# EAGLE schematic module_alu1_ctrl (EAGLE 6.5.0)

## Sheet 1 of 14
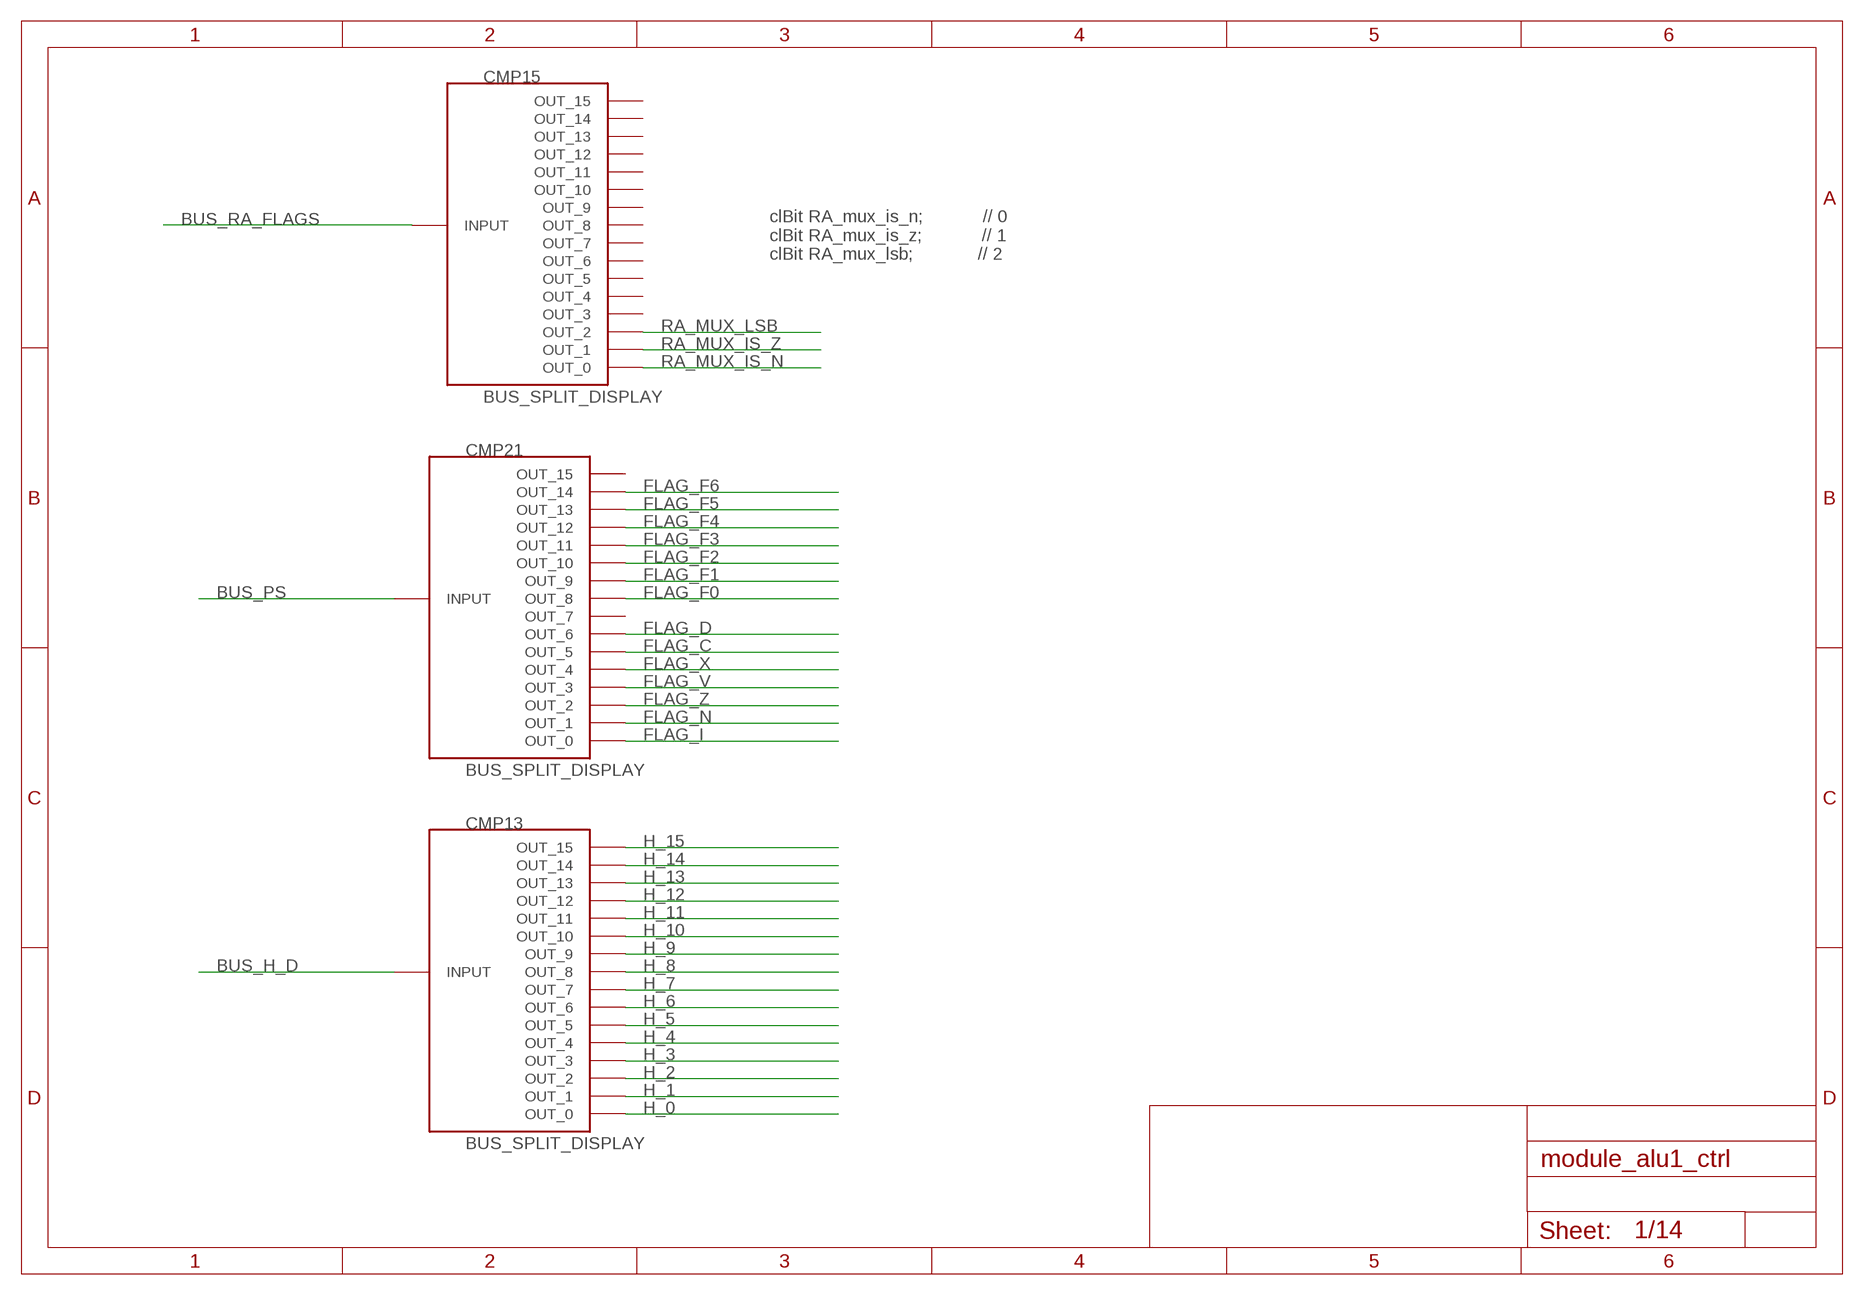
[diagram p0: schematic, sheet 1]

### Parts
CMP13  BUS_SPLIT_DISPLAY  [BUS_SPLIT_DISPLAY]
CMP15  BUS_SPLIT_DISPLAY  [BUS_SPLIT_DISPLAY]
CMP21  BUS_SPLIT_DISPLAY  [BUS_SPLIT_DISPLAY]

### Nets
BUS_H_D: CMP13.INPUT
BUS_PS: CMP21.INPUT
BUS_RA_FLAGS: CMP15.INPUT
FLAG_C: CMP21.P$6(OUT_5)
FLAG_D: CMP21.P$7(OUT_6)
FLAG_F0: CMP21.P$9(OUT_8)
FLAG_F1: CMP21.P$10(OUT_9)
FLAG_F2: CMP21.P$11(OUT_10)
FLAG_F3: CMP21.P$12(OUT_11) ; also sheet 6
FLAG_F4: CMP21.P$13(OUT_12)
FLAG_F5: CMP21.P$14(OUT_13)
FLAG_F6: CMP21.P$15(OUT_14) ; also sheet 11
FLAG_I: CMP21.P$1(OUT_0)
FLAG_N: CMP21.P$2(OUT_1)
FLAG_V: CMP21.P$4(OUT_3)
FLAG_X: CMP21.P$5(OUT_4) ; also sheet 7,9
FLAG_Z: CMP21.P$3(OUT_2)
H_0: CMP13.P$1(OUT_0) ; also sheet 14
H_1: CMP13.P$2(OUT_1) ; also sheet 4,14
H_2: CMP13.P$3(OUT_2) ; also sheet 4,14
H_3: CMP13.P$4(OUT_3) ; also sheet 4,14
H_4: CMP13.P$5(OUT_4) ; also sheet 7,8,14
H_5: CMP13.P$6(OUT_5)
H_6: CMP13.P$7(OUT_6) ; also sheet 5
H_7: CMP13.P$8(OUT_7) ; also sheet 5
H_8: CMP13.P$9(OUT_8)
H_9: CMP13.P$10(OUT_9)
H_10: CMP13.P$11(OUT_10)
H_11: CMP13.P$12(OUT_11)
H_12: CMP13.P$13(OUT_12)
H_13: CMP13.P$14(OUT_13)
H_14: CMP13.P$15(OUT_14)
H_15: CMP13.P$16(OUT_15)
RA_MUX_IS_N: CMP15.P$1(OUT_0) ; also sheet 7,9
RA_MUX_IS_Z: CMP15.P$2(OUT_1)
RA_MUX_LSB: CMP15.P$3(OUT_2) ; also sheet 9,13
Unconnected: CMP15.P$4(OUT_3) CMP15.P$5(OUT_4) CMP15.P$6(OUT_5) CMP15.P$7(OUT_6) CMP15.P$8(OUT_7) CMP15.P$9(OUT_8) CMP15.P$10(OUT_9) CMP15.P$11(OUT_10) CMP15.P$12(OUT_11) CMP15.P$13(OUT_12) CMP15.P$14(OUT_13) CMP15.P$15(OUT_14) CMP15.P$16(OUT_15) CMP21.P$8(OUT_7) CMP21.P$16(OUT_15)

### Notes on the sheet
- clBit RA_mux_is_n;            // 0 
      clBit RA_mux_is_z;            // 1
      clBit RA_mux_lsb;             // 2

## Sheet 2 of 14
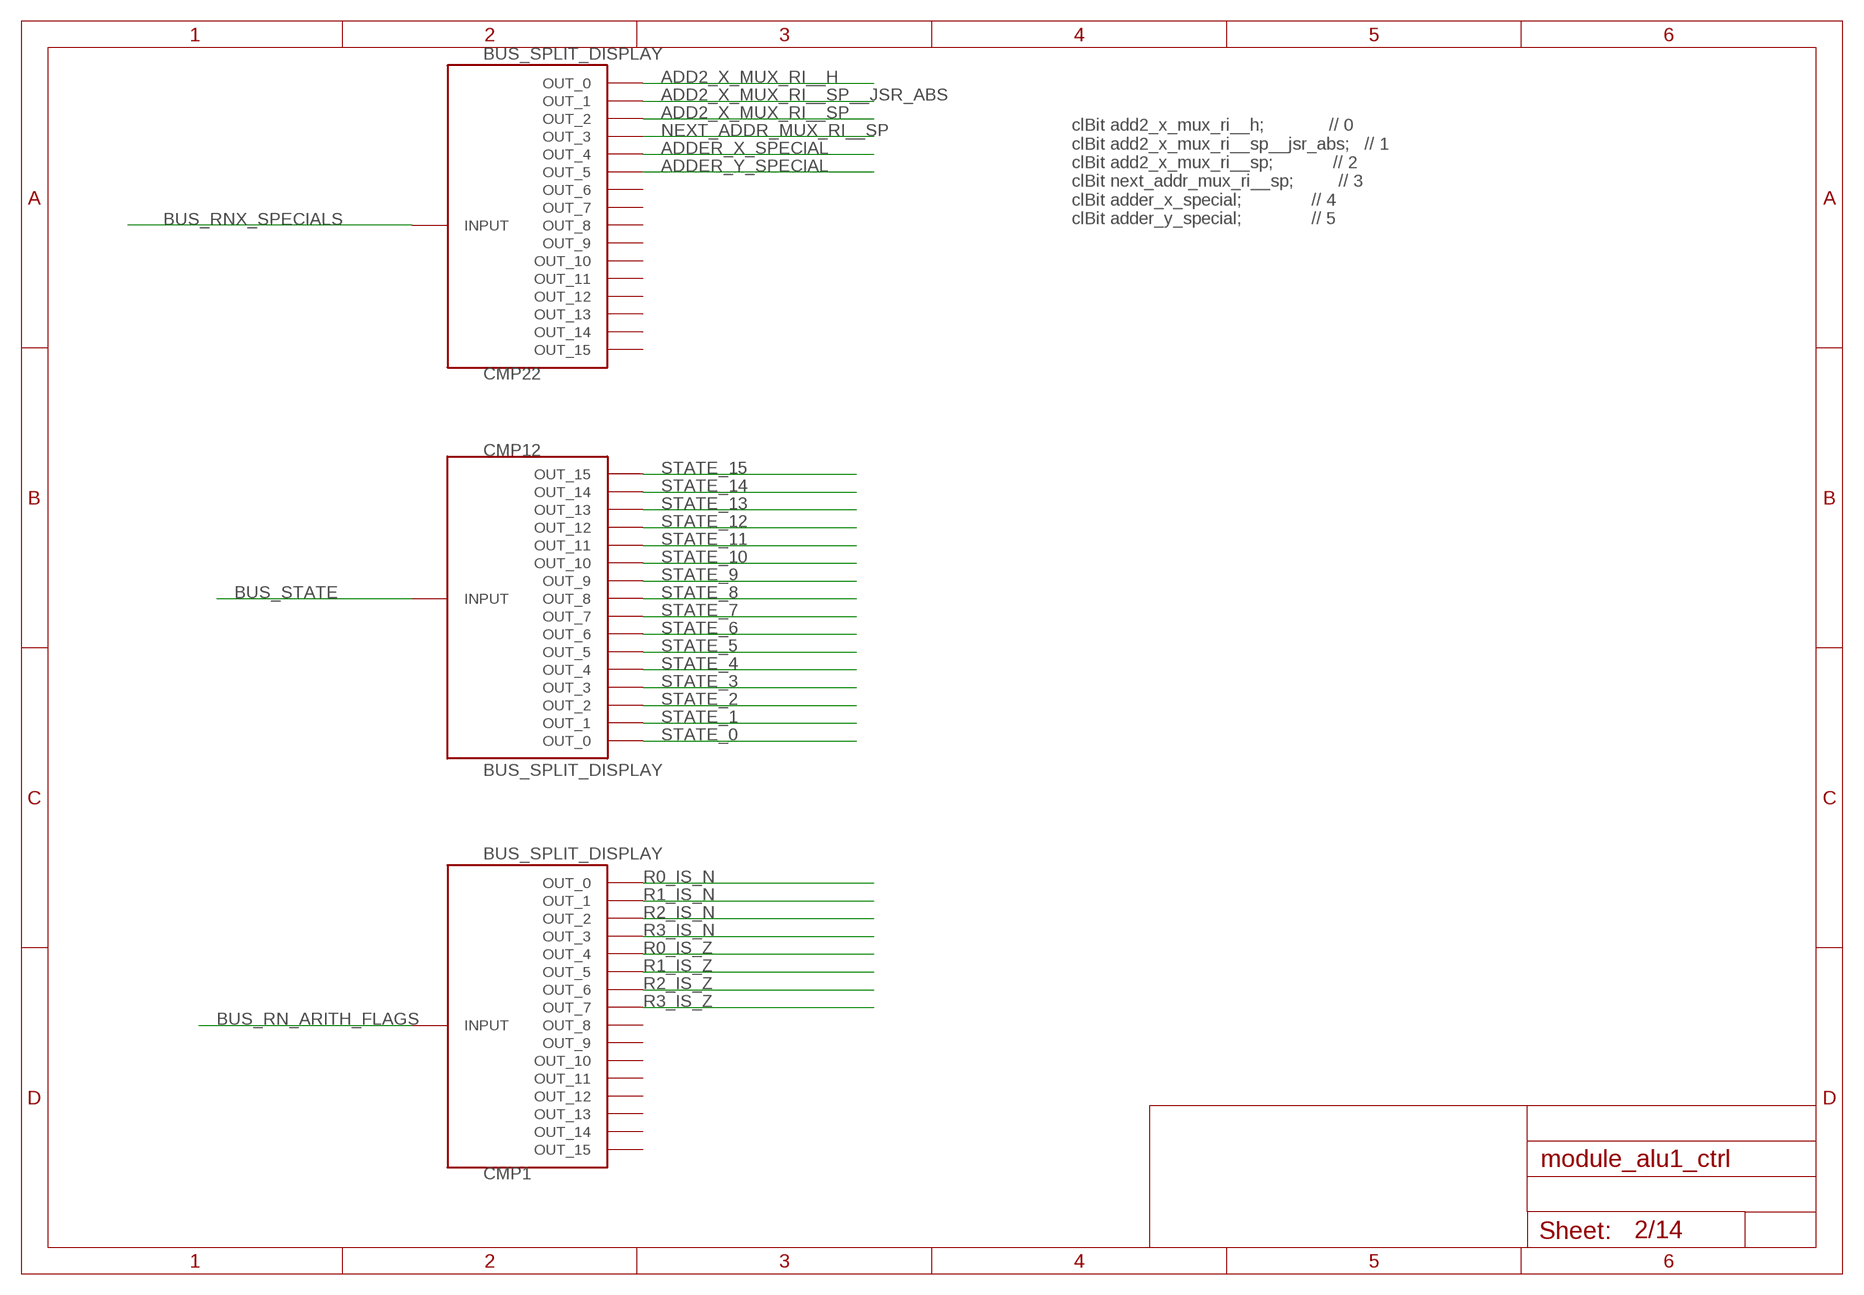
[diagram p1: schematic, sheet 2]

### Parts
CMP1  BUS_SPLIT_DISPLAY  [BUS_SPLIT_DISPLAY]
CMP12  BUS_SPLIT_DISPLAY  [BUS_SPLIT_DISPLAY]
CMP22  BUS_SPLIT_DISPLAY  [BUS_SPLIT_DISPLAY]

### Nets
ADD2_X_MUX_RI__H: CMP22.P$1(OUT_0) ; also sheet 11
ADD2_X_MUX_RI__SP: CMP22.P$3(OUT_2) ; also sheet 11
ADD2_X_MUX_RI__SP__JSR_ABS: CMP22.P$2(OUT_1)
ADDER_X_SPECIAL: CMP22.P$5(OUT_4) ; also sheet 6
ADDER_Y_SPECIAL: CMP22.P$6(OUT_5) ; also sheet 6
BUS_RN_ARITH_FLAGS: CMP1.INPUT
BUS_RNX_SPECIALS: CMP22.INPUT
BUS_STATE: CMP12.INPUT
NEXT_ADDR_MUX_RI__SP: CMP22.P$4(OUT_3)
R0_IS_N: CMP1.P$1(OUT_0) ; also sheet 11,13
R0_IS_Z: CMP1.P$5(OUT_4)
R1_IS_N: CMP1.P$2(OUT_1) ; also sheet 12
R1_IS_Z: CMP1.P$6(OUT_5)
R2_IS_N: CMP1.P$3(OUT_2)
R2_IS_Z: CMP1.P$7(OUT_6)
R3_IS_N: CMP1.P$4(OUT_3)
R3_IS_Z: CMP1.P$8(OUT_7)
STATE_0: CMP12.P$1(OUT_0) ; also sheet 11,13
STATE_1: CMP12.P$2(OUT_1) ; also sheet 5,8
STATE_2: CMP12.P$3(OUT_2) ; also sheet 11
STATE_3: CMP12.P$4(OUT_3) ; also sheet 7,12
STATE_4: CMP12.P$5(OUT_4)
STATE_5: CMP12.P$6(OUT_5)
STATE_6: CMP12.P$7(OUT_6) ; also sheet 13
STATE_7: CMP12.P$8(OUT_7) ; also sheet 12,13
STATE_8: CMP12.P$9(OUT_8)
STATE_9: CMP12.P$10(OUT_9)
STATE_10: CMP12.P$11(OUT_10) ; also sheet 11,12,14
STATE_11: CMP12.P$12(OUT_11) ; also sheet 5,11
STATE_12: CMP12.P$13(OUT_12) ; also sheet 11
STATE_13: CMP12.P$14(OUT_13) ; also sheet 5,6,11,12,14
STATE_14: CMP12.P$15(OUT_14) ; also sheet 11,12,13
STATE_15: CMP12.P$16(OUT_15) ; also sheet 13
Unconnected: CMP1.P$9(OUT_8) CMP1.P$10(OUT_9) CMP1.P$11(OUT_10) CMP1.P$12(OUT_11) CMP1.P$13(OUT_12) CMP1.P$14(OUT_13) CMP1.P$15(OUT_14) CMP1.P$16(OUT_15) CMP22.P$7(OUT_6) CMP22.P$8(OUT_7) CMP22.P$9(OUT_8) CMP22.P$10(OUT_9) CMP22.P$11(OUT_10) CMP22.P$12(OUT_11) CMP22.P$13(OUT_12) CMP22.P$14(OUT_13) CMP22.P$15(OUT_14) CMP22.P$16(OUT_15)

### Notes on the sheet
- clBit add2_x_mux_ri__h;             // 0
      clBit add2_x_mux_ri__sp__jsr_abs;   // 1
      clBit add2_x_mux_ri__sp;            // 2
      clBit next_addr_mux_ri__sp;         // 3
      clBit adder_x_special;              // 4
      clBit adder_y_special;              // 5

## Sheet 3 of 14
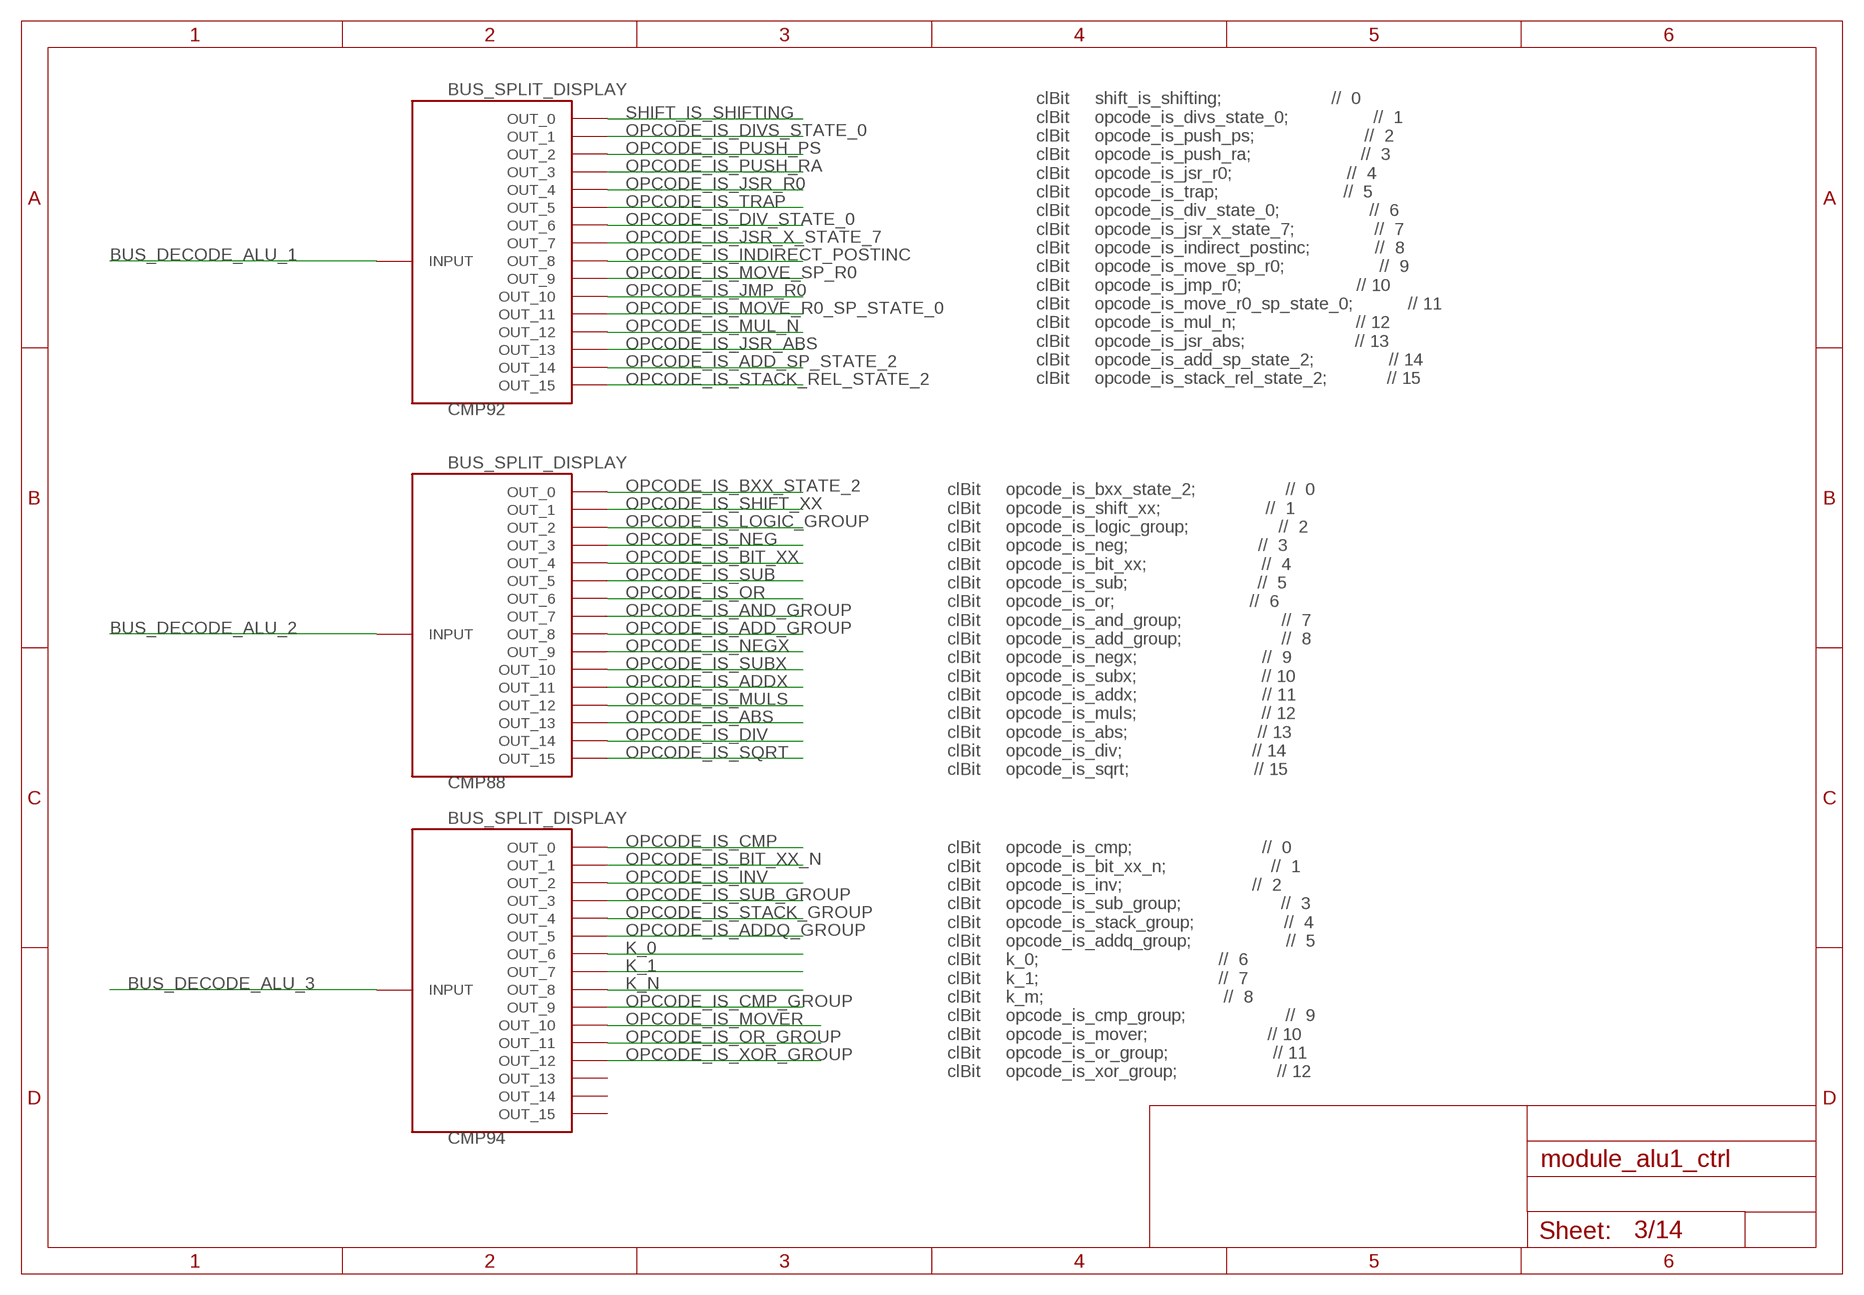
[diagram p2: schematic, sheet 3]

### Parts
CMP88  BUS_SPLIT_DISPLAY  [BUS_SPLIT_DISPLAY]
CMP92  BUS_SPLIT_DISPLAY  [BUS_SPLIT_DISPLAY]
CMP94  BUS_SPLIT_DISPLAY  [BUS_SPLIT_DISPLAY]

### Nets
BUS_DECODE_ALU_1: CMP92.INPUT
BUS_DECODE_ALU_2: CMP88.INPUT
BUS_DECODE_ALU_3: CMP94.INPUT
K_0: CMP94.P$7(OUT_6) ; also sheet 14
K_1: CMP94.P$8(OUT_7) ; also sheet 14
K_N: CMP94.P$9(OUT_8) ; also sheet 14
OPCODE_IS_ABS: CMP88.P$14(OUT_13) ; also sheet 7
OPCODE_IS_ADD_GROUP: CMP88.P$9(OUT_8) ; also sheet 5,6,8
OPCODE_IS_ADD_SP_STATE_2: CMP92.P$15(OUT_14) ; also sheet 12
OPCODE_IS_ADDQ_GROUP: CMP94.P$6(OUT_5) ; also sheet 5,6,8
OPCODE_IS_ADDX: CMP88.P$12(OUT_11) ; also sheet 7,8
OPCODE_IS_AND_GROUP: CMP88.P$8(OUT_7) ; also sheet 5,6,10
OPCODE_IS_BIT_XX: CMP88.P$5(OUT_4) ; also sheet 5,10
OPCODE_IS_BIT_XX_N: CMP94.P$2(OUT_1) ; also sheet 5
OPCODE_IS_BXX_STATE_2: CMP88.P$1(OUT_0) ; also sheet 12
OPCODE_IS_CMP: CMP94.P$1(OUT_0) ; also sheet 5,7,8
OPCODE_IS_CMP_GROUP: CMP94.P$10(OUT_9) ; also sheet 6
OPCODE_IS_DIV: CMP88.P$15(OUT_14) ; also sheet 7
OPCODE_IS_DIV_STATE_0: CMP92.P$7(OUT_6) ; also sheet 11,12
OPCODE_IS_DIVS_STATE_0: CMP92.P$2(OUT_1) ; also sheet 13
OPCODE_IS_INDIRECT_POSTINC: CMP92.P$9(OUT_8) ; also sheet 11
OPCODE_IS_INV: CMP94.P$3(OUT_2) ; also sheet 5,6
OPCODE_IS_JMP_R0: CMP92.P$11(OUT_10) ; also sheet 11
OPCODE_IS_JSR_ABS: CMP92.P$14(OUT_13) ; also sheet 12
OPCODE_IS_JSR_R0: CMP92.P$5(OUT_4) ; also sheet 12,13
OPCODE_IS_JSR_X_STATE_7: CMP92.P$8(OUT_7) ; also sheet 11
OPCODE_IS_LOGIC_GROUP: CMP88.P$3(OUT_2) ; also sheet 10
OPCODE_IS_MOVE_R0_SP_STATE_0: CMP92.P$12(OUT_11) ; also sheet 12
OPCODE_IS_MOVE_SP_R0: CMP92.P$10(OUT_9) ; also sheet 11
OPCODE_IS_MOVER: CMP94.P$11(OUT_10) ; also sheet 6
OPCODE_IS_MUL_N: CMP92.P$13(OUT_12) ; also sheet 12
OPCODE_IS_MULS: CMP88.P$13(OUT_12) ; also sheet 7
OPCODE_IS_NEG: CMP88.P$4(OUT_3) ; also sheet 8
OPCODE_IS_NEGX: CMP88.P$10(OUT_9) ; also sheet 7,8
OPCODE_IS_OR: CMP88.P$7(OUT_6) ; also sheet 6,10
OPCODE_IS_OR_GROUP: CMP94.P$12(OUT_11) ; also sheet 5
OPCODE_IS_PUSH_PS: CMP92.P$3(OUT_2) ; also sheet 13
OPCODE_IS_PUSH_RA: CMP92.P$4(OUT_3) ; also sheet 13
OPCODE_IS_SHIFT_XX: CMP88.P$2(OUT_1) ; also sheet 6,7,8,11
OPCODE_IS_SQRT: CMP88.P$16(OUT_15) ; also sheet 7
OPCODE_IS_STACK_GROUP: CMP94.P$5(OUT_4) ; also sheet 6,13
OPCODE_IS_STACK_REL_STATE_2: CMP92.P$16(OUT_15) ; also sheet 12
OPCODE_IS_SUB: CMP88.P$6(OUT_5) ; also sheet 5,8
OPCODE_IS_SUB_GROUP: CMP94.P$4(OUT_3) ; also sheet 6,7
OPCODE_IS_SUBX: CMP88.P$11(OUT_10) ; also sheet 7,8
OPCODE_IS_TRAP: CMP92.P$6(OUT_5) ; also sheet 13
OPCODE_IS_XOR_GROUP: CMP94.P$13(OUT_12) ; also sheet 5,6
SHIFT_IS_SHIFTING: CMP92.P$1(OUT_0) ; also sheet 13
Unconnected: CMP94.P$14(OUT_13) CMP94.P$15(OUT_14) CMP94.P$16(OUT_15)

### Notes on the sheet
- clBit     shift_is_shifting;                      //  0
      clBit     opcode_is_divs_state_0;                 //  1
      clBit     opcode_is_push_ps;                      //  2
      clBit     opcode_is_push_ra;                      //  3
      clBit     opcode_is_jsr_r0;                       //  4
      clBit     opcode_is_trap;                         //  5
      clBit     opcode_is_div_state_0;                  //  6
      clBit     opcode_is_jsr_x_state_7;                //  7
      clBit     opcode_is_indirect_postinc;             //  8
      clBit     opcode_is_move_sp_r0;                   //  9
      clBit     opcode_is_jmp_r0;                       // 10
      clBit     opcode_is_move_r0_sp_state_0;           // 11
      clBit     opcode_is_mul_n;                        // 12
      clBit     opcode_is_jsr_abs;                      // 13
      clBit     opcode_is_add_sp_state_2;               // 14
      clBit     opcode_is_stack_rel_state_2;            // 15
- clBit     opcode_is_bxx_state_2;                  //  0
      clBit     opcode_is_shift_xx;                     //  1
      clBit     opcode_is_logic_group;                  //  2
      clBit     opcode_is_neg;                          //  3
      clBit     opcode_is_bit_xx;                       //  4
      clBit     opcode_is_sub;                          //  5
      clBit     opcode_is_or;                           //  6
      clBit     opcode_is_and_group;                    //  7
      clBit     opcode_is_add_group;                    //  8
      clBit     opcode_is_negx;                         //  9
      clBit     opcode_is_subx;                         // 10
      clBit     opcode_is_addx;                         // 11
      clBit     opcode_is_muls;                         // 12
      clBit     opcode_is_abs;                          // 13
      clBit     opcode_is_div;                          // 14
      clBit     opcode_is_sqrt;                         // 15
- clBit     opcode_is_cmp;                          //  0
      clBit     opcode_is_bit_xx_n;                     //  1
      clBit     opcode_is_inv;                          //  2
      clBit     opcode_is_sub_group;                    //  3
      clBit     opcode_is_stack_group;                  //  4
      clBit     opcode_is_addq_group;                   //  5
      clBit     k_0;                                    //  6
      clBit     k_1;                                    //  7
      clBit     k_m;                                    //  8
      clBit     opcode_is_cmp_group;                    //  9 
      clBit     opcode_is_mover;                        // 10
      clBit     opcode_is_or_group;                     // 11
      clBit     opcode_is_xor_group;                    // 12

## Sheet 4 of 14
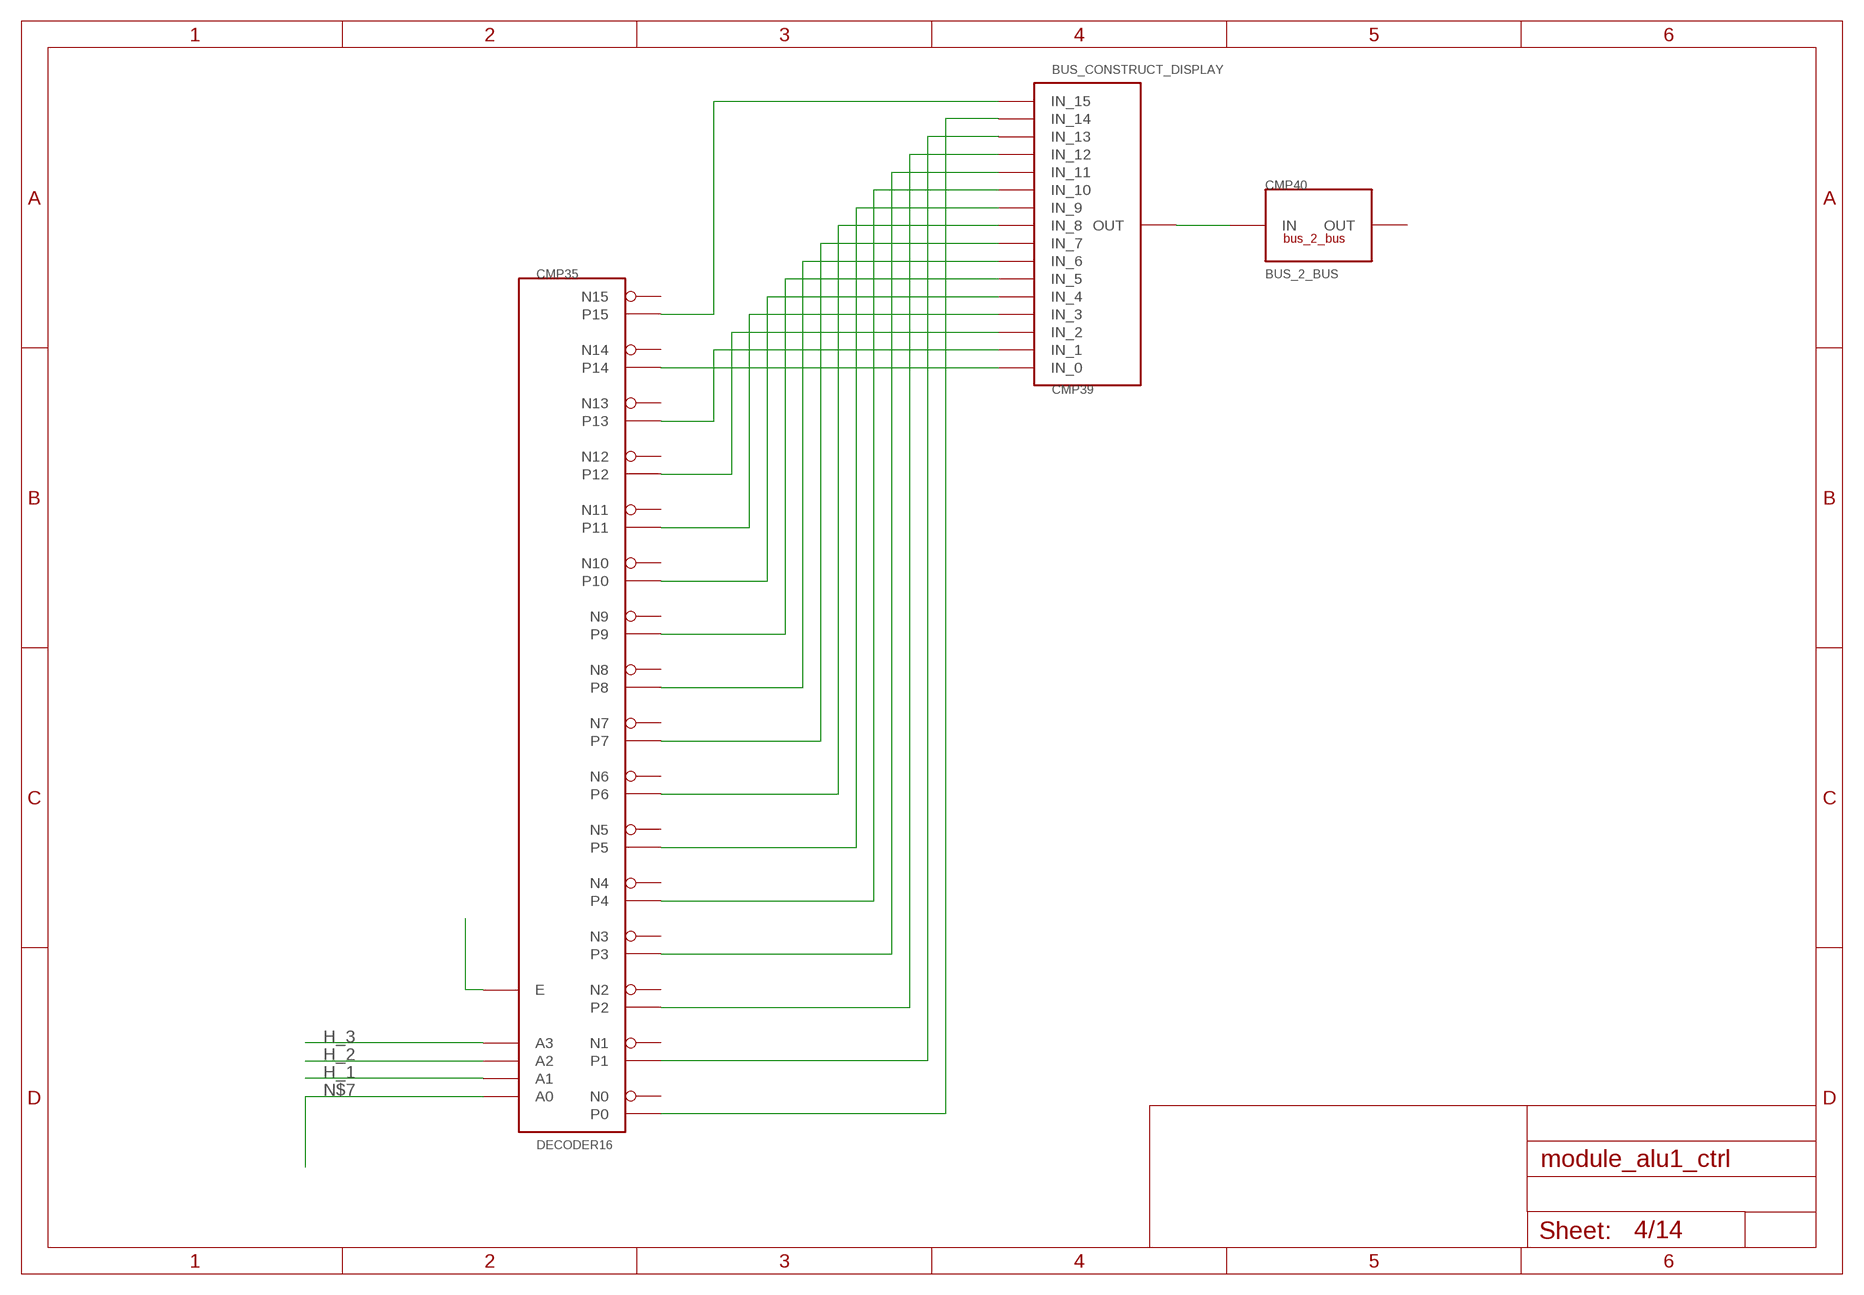
[diagram p3: schematic, sheet 4]

### Parts
CMP35  DECODER16  [DECODER16]
CMP39  BUS_CONSTRUCT_DISPLAY  [BUS_SPLIT_DISPLAY]
CMP40  BUS_2_BUS  [BUS2BUS]

### Nets
H_1: CMP35.A1 ; also sheet 1,14
H_2: CMP35.A2 ; also sheet 1,14
H_3: CMP35.A3 ; also sheet 1,14
N$2: CMP35.E
N$4: CMP35.P0 CMP39.P$15(IN_14)
N$5: CMP35.P1 CMP39.P$14(IN_13)
N$6: CMP35.P2 CMP39.P$13(IN_12)
N$7: CMP35.A0
N$8: CMP35.P3 CMP39.P$12(IN_11)
N$9: CMP35.P4 CMP39.P$11(IN_10)
N$10: CMP35.P5 CMP39.P$10(IN_9)
N$11: CMP35.P6 CMP39.P$9(IN_8)
N$12: CMP35.P7 CMP39.P$8(IN_7)
N$13: CMP35.P8 CMP39.P$7(IN_6)
N$14: CMP35.P9 CMP39.P$6(IN_5)
N$15: CMP35.P10 CMP39.P$5(IN_4)
N$16: CMP35.P11 CMP39.P$4(IN_3)
N$17: CMP35.P12 CMP39.P$3(IN_2)
N$18: CMP35.P13 CMP39.P$2(IN_1)
N$19: CMP35.P14 CMP39.P$1(IN_0)
N$20: CMP35.P15 CMP39.P$16(IN_15)
N$21: CMP39.INPUT(OUT) CMP40.P$1(IN)
Unconnected: CMP35.N0 CMP35.N1 CMP35.N2 CMP35.N3 CMP35.N4 CMP35.N5 CMP35.N6 CMP35.N7 CMP35.N8 CMP35.N9 CMP35.N10 CMP35.N11 CMP35.N12 CMP35.N13 CMP35.N14 CMP35.N15 CMP40.P$2(OUT)

## Sheet 5 of 14
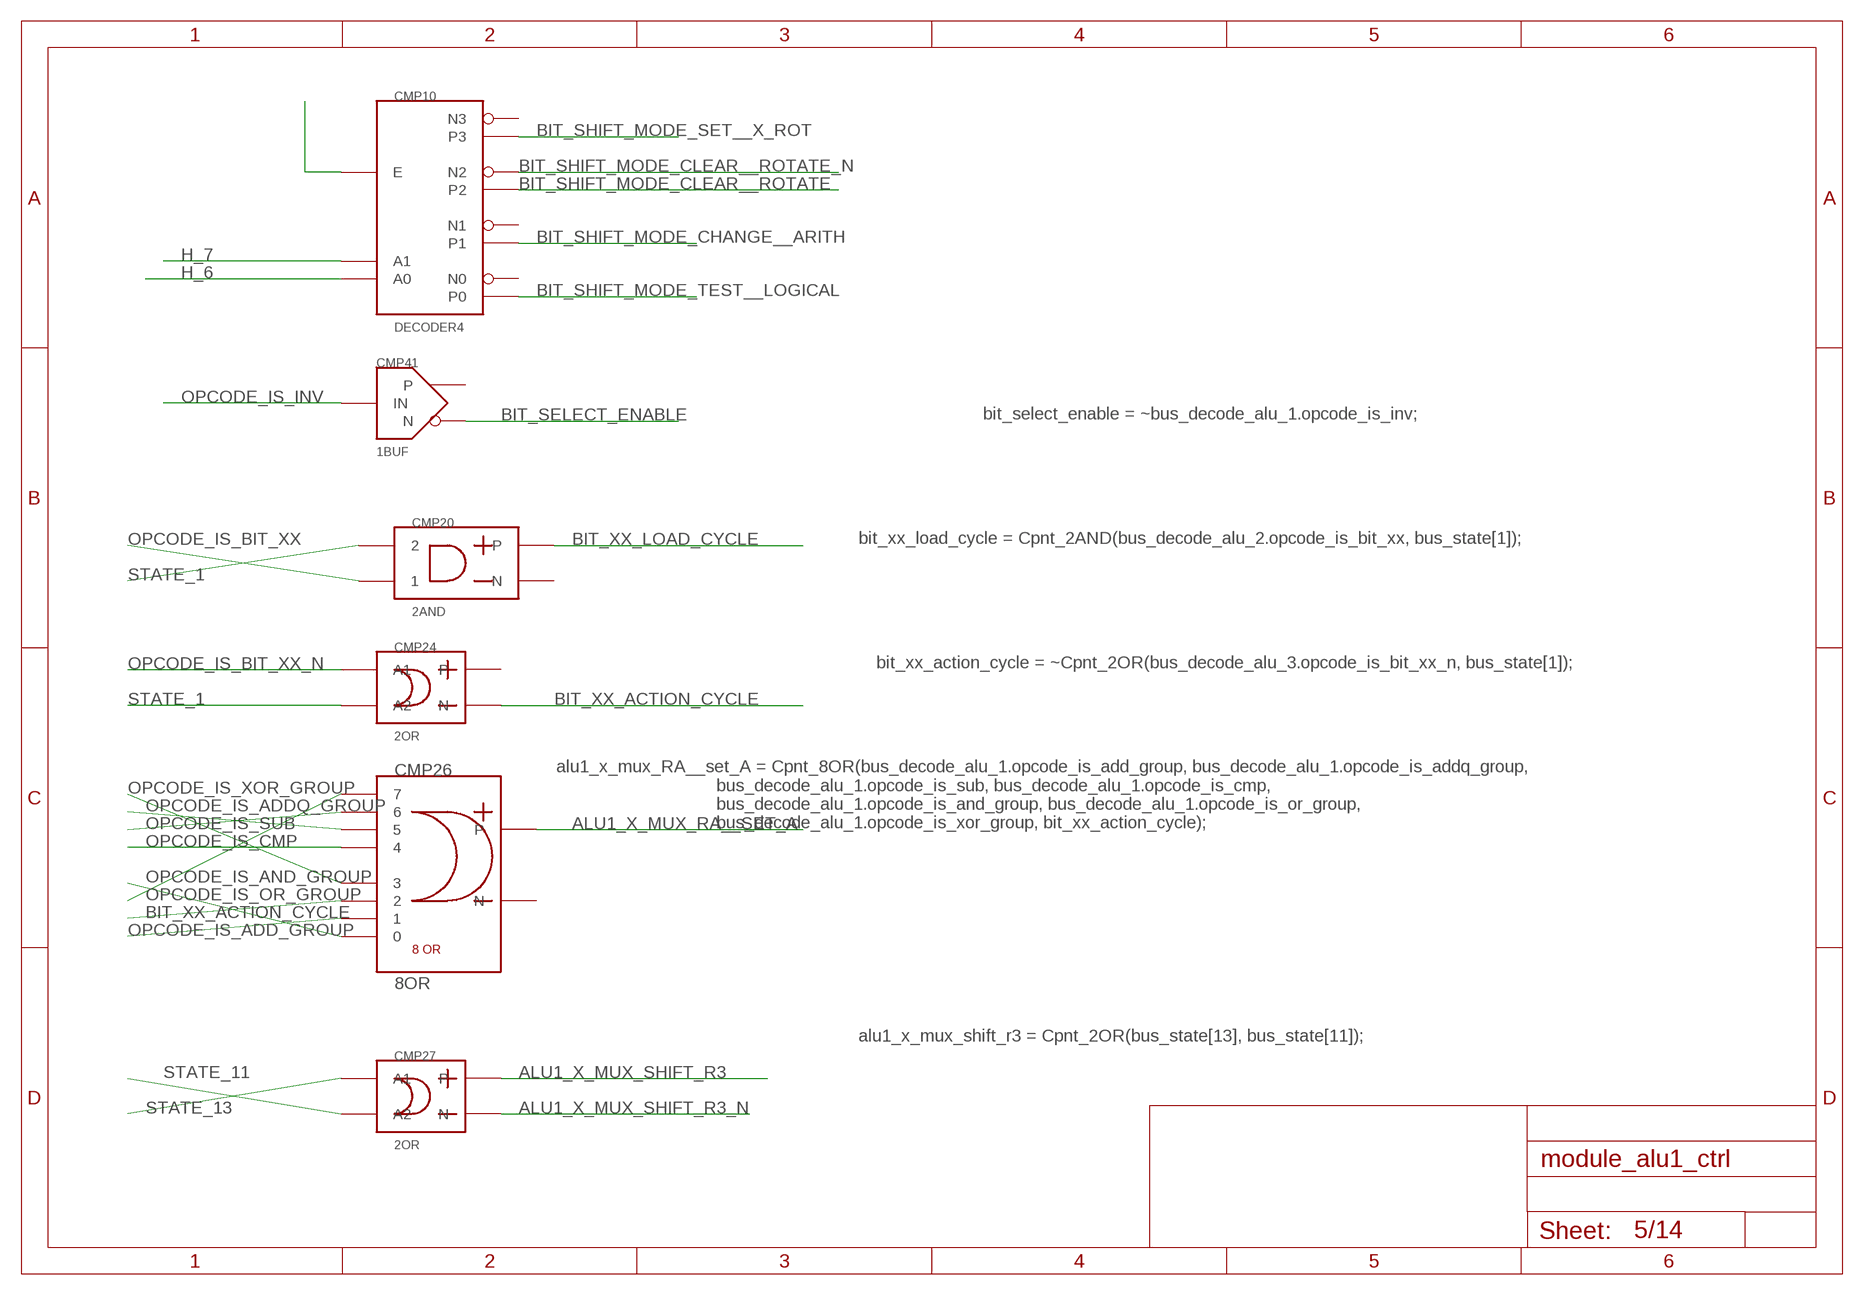
[diagram p4: schematic, sheet 5]

### Parts
CMP10  DECODER4  [DECODER4]
CMP20  2AND  [2AND]
CMP24  2OR  [2OR]
CMP26  8OR  [8OR]
CMP27  2OR  [2OR]
CMP41  1BUF  [1BUF]

### Nets
ALU1_X_MUX_RA__SET_A: CMP26.OUT_P(P) ; also sheet 6
ALU1_X_MUX_SHIFT_R3: CMP27.OUT_P(P) ; also sheet 14
ALU1_X_MUX_SHIFT_R3_N: CMP27.OUT_M(N) ; also sheet 6
BIT_SELECT_ENABLE: CMP41.N ; also sheet 14
BIT_SHIFT_MODE_CHANGE__ARITH: CMP10.P1 ; also sheet 9
BIT_SHIFT_MODE_CLEAR__ROTATE: CMP10.P2 ; also sheet 6,9,10
BIT_SHIFT_MODE_CLEAR__ROTATE_N: CMP10.N2 ; also sheet 6
BIT_SHIFT_MODE_SET__X_ROT: CMP10.P3 ; also sheet 9,10
BIT_SHIFT_MODE_TEST__LOGICAL: CMP10.P0
BIT_XX_ACTION_CYCLE: CMP24.OUT_M(N) CMP26.3 ; also sheet 6
BIT_XX_LOAD_CYCLE: CMP20.OUT_P(P) ; also sheet 6
H_6: CMP10.A0 ; also sheet 1
H_7: CMP10.A1 ; also sheet 1
N$3: CMP10.E
OPCODE_IS_ADD_GROUP: CMP26.2 ; also sheet 3,6,8
OPCODE_IS_ADDQ_GROUP: CMP26.6 ; also sheet 3,6,8
OPCODE_IS_AND_GROUP: CMP26.1 ; also sheet 3,6,10
OPCODE_IS_BIT_XX: CMP20.P$1 ; also sheet 3,10
OPCODE_IS_BIT_XX_N: CMP24.P$2(A1) ; also sheet 3
OPCODE_IS_CMP: CMP26.5 ; also sheet 3,7,8
OPCODE_IS_INV: CMP41.IN ; also sheet 3,6
OPCODE_IS_OR_GROUP: CMP26.8 ; also sheet 3
OPCODE_IS_SUB: CMP26.7 ; also sheet 3,8
OPCODE_IS_XOR_GROUP: CMP26.4 ; also sheet 3,6
STATE_1: CMP20.P$2 CMP24.P$1(A2) ; also sheet 2,8
STATE_11: CMP27.P$1(A2) ; also sheet 2,11
STATE_13: CMP27.P$2(A1) ; also sheet 2,6,11,12,14
Unconnected: CMP10.N0 CMP10.N1 CMP10.N3 CMP20.OUT_M(N) CMP24.OUT_P(P) CMP26.OUT_M(N) CMP41.P

### Notes on the sheet
- bit_select_enable = ~bus_decode_alu_1.opcode_is_inv;
- bit_xx_load_cycle = Cpnt_2AND(bus_decode_alu_2.opcode_is_bit_xx, bus_state[1]);
- bit_xx_action_cycle = ~Cpnt_2OR(bus_decode_alu_3.opcode_is_bit_xx_n, bus_state[1]);
- alu1_x_mux_RA__set_A = Cpnt_8OR(bus_decode_alu_1.opcode_is_add_group, bus_decode_alu_1.opcode_is_addq_group,
                                      bus_decode_alu_1.opcode_is_sub, bus_decode_alu_1.opcode_is_cmp,
                                      bus_decode_alu_1.opcode_is_and_group, bus_decode_alu_1.opcode_is_or_group,
                                      bus_decode_alu_1.opcode_is_xor_group, bit_xx_action_cycle);
- alu1_x_mux_shift_r3 = Cpnt_2OR(bus_state[13], bus_state[11]);

## Sheet 6 of 14
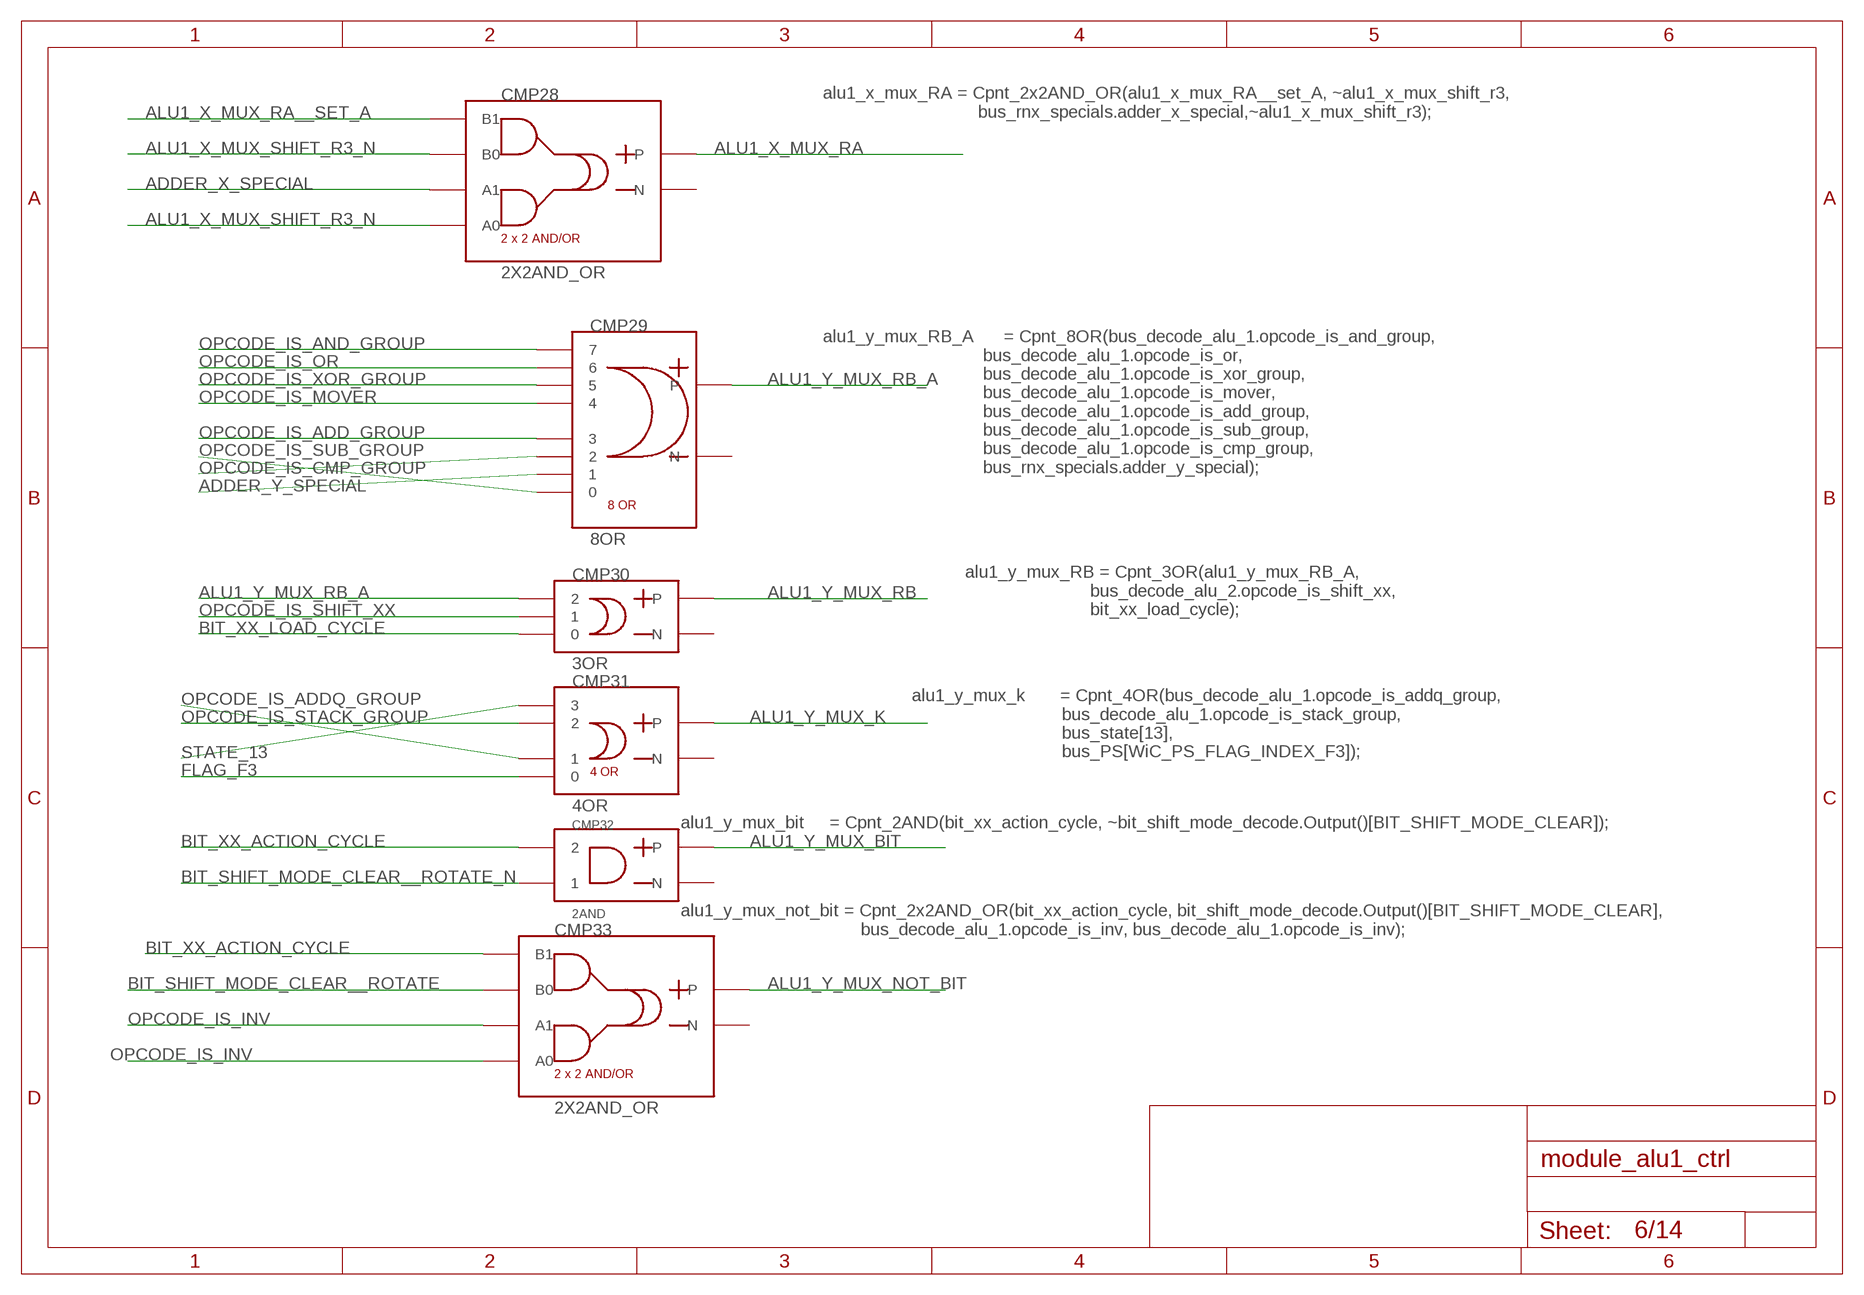
[diagram p5: schematic, sheet 6]

### Parts
CMP28  2X2AND_OR  [2X2AND_OR]
CMP29  8OR  [8OR]
CMP30  3OR  [3OR]
CMP31  4OR  [4OR]
CMP32  2AND  [2AND]
CMP33  2X2AND_OR  [2X2AND_OR]

### Nets
ADDER_X_SPECIAL: CMP28.P$2(A1) ; also sheet 2
ADDER_Y_SPECIAL: CMP29.2 ; also sheet 2
ALU1_X_MUX_RA: CMP28.OUT_P(P) ; also sheet 14
ALU1_X_MUX_RA__SET_A: CMP28.P$4(B1) ; also sheet 5
ALU1_X_MUX_SHIFT_R3_N: CMP28.P$1(A0) CMP28.P$3(B0) ; also sheet 5
ALU1_Y_MUX_BIT: CMP32.OUT_P(P) ; also sheet 14
ALU1_Y_MUX_K: CMP31.OUT_P(P) ; also sheet 14
ALU1_Y_MUX_NOT_BIT: CMP33.OUT_P(P) ; also sheet 14
ALU1_Y_MUX_RB: CMP30.OUT_P(P) ; also sheet 14
ALU1_Y_MUX_RB_A: CMP29.OUT_P(P) CMP30.P$3
BIT_SHIFT_MODE_CLEAR__ROTATE: CMP33.P$3(B0) ; also sheet 5,9,10
BIT_SHIFT_MODE_CLEAR__ROTATE_N: CMP32.P$1 ; also sheet 5
BIT_XX_ACTION_CYCLE: CMP32.P$2 CMP33.P$4(B1) ; also sheet 5
BIT_XX_LOAD_CYCLE: CMP30.P$1 ; also sheet 5
FLAG_F3: CMP31.1 ; also sheet 1
OPCODE_IS_ADD_GROUP: CMP29.4 ; also sheet 3,5,8
OPCODE_IS_ADDQ_GROUP: CMP31.2 ; also sheet 3,5,8
OPCODE_IS_AND_GROUP: CMP29.8 ; also sheet 3,5,10
OPCODE_IS_CMP_GROUP: CMP29.3 ; also sheet 3
OPCODE_IS_INV: CMP33.P$1(A0) CMP33.P$2(A1) ; also sheet 3,5
OPCODE_IS_MOVER: CMP29.5 ; also sheet 3
OPCODE_IS_OR: CMP29.7 ; also sheet 3,10
OPCODE_IS_SHIFT_XX: CMP30.P$2 ; also sheet 3,7,8,11
OPCODE_IS_STACK_GROUP: CMP31.3 ; also sheet 3,13
OPCODE_IS_SUB_GROUP: CMP29.1 ; also sheet 3,7
OPCODE_IS_XOR_GROUP: CMP29.6 ; also sheet 3,5
STATE_13: CMP31.4 ; also sheet 2,5,11,12,14
Unconnected: CMP28.OUT_M(N) CMP29.OUT_M(N) CMP30.OUT_M(N) CMP31.OUT_M(N) CMP32.OUT_M(N) CMP33.OUT_M(N)

### Notes on the sheet
- alu1_x_mux_RA = Cpnt_2x2AND_OR(alu1_x_mux_RA__set_A, ~alu1_x_mux_shift_r3,
                                     bus_rnx_specials.adder_x_special,~alu1_x_mux_shift_r3);
- alu1_y_mux_RB_A      = Cpnt_8OR(bus_decode_alu_1.opcode_is_and_group,
                                      bus_decode_alu_1.opcode_is_or,
                                      bus_decode_alu_1.opcode_is_xor_group,
                                      bus_decode_alu_1.opcode_is_mover,
                                      bus_decode_alu_1.opcode_is_add_group,
                                      bus_decode_alu_1.opcode_is_sub_group,
                                      bus_decode_alu_1.opcode_is_cmp_group,
                                      bus_rnx_specials.adder_y_special);
- alu1_y_mux_RB = Cpnt_3OR(alu1_y_mux_RB_A,
                               bus_decode_alu_2.opcode_is_shift_xx,
                               bit_xx_load_cycle);
- alu1_y_mux_k       = Cpnt_4OR(bus_decode_alu_1.opcode_is_addq_group,
                                    bus_decode_alu_1.opcode_is_stack_group,
                                    bus_state[13],
                                    bus_PS[WiC_PS_FLAG_INDEX_F3]);
- alu1_y_mux_bit     = Cpnt_2AND(bit_xx_action_cycle, ~bit_shift_mode_decode.Output()[BIT_SHIFT_MODE_CLEAR]);
- alu1_y_mux_not_bit = Cpnt_2x2AND_OR(bit_xx_action_cycle, bit_shift_mode_decode.Output()[BIT_SHIFT_MODE_CLEAR],
                                          bus_decode_alu_1.opcode_is_inv, bus_decode_alu_1.opcode_is_inv);

## Sheet 7 of 14
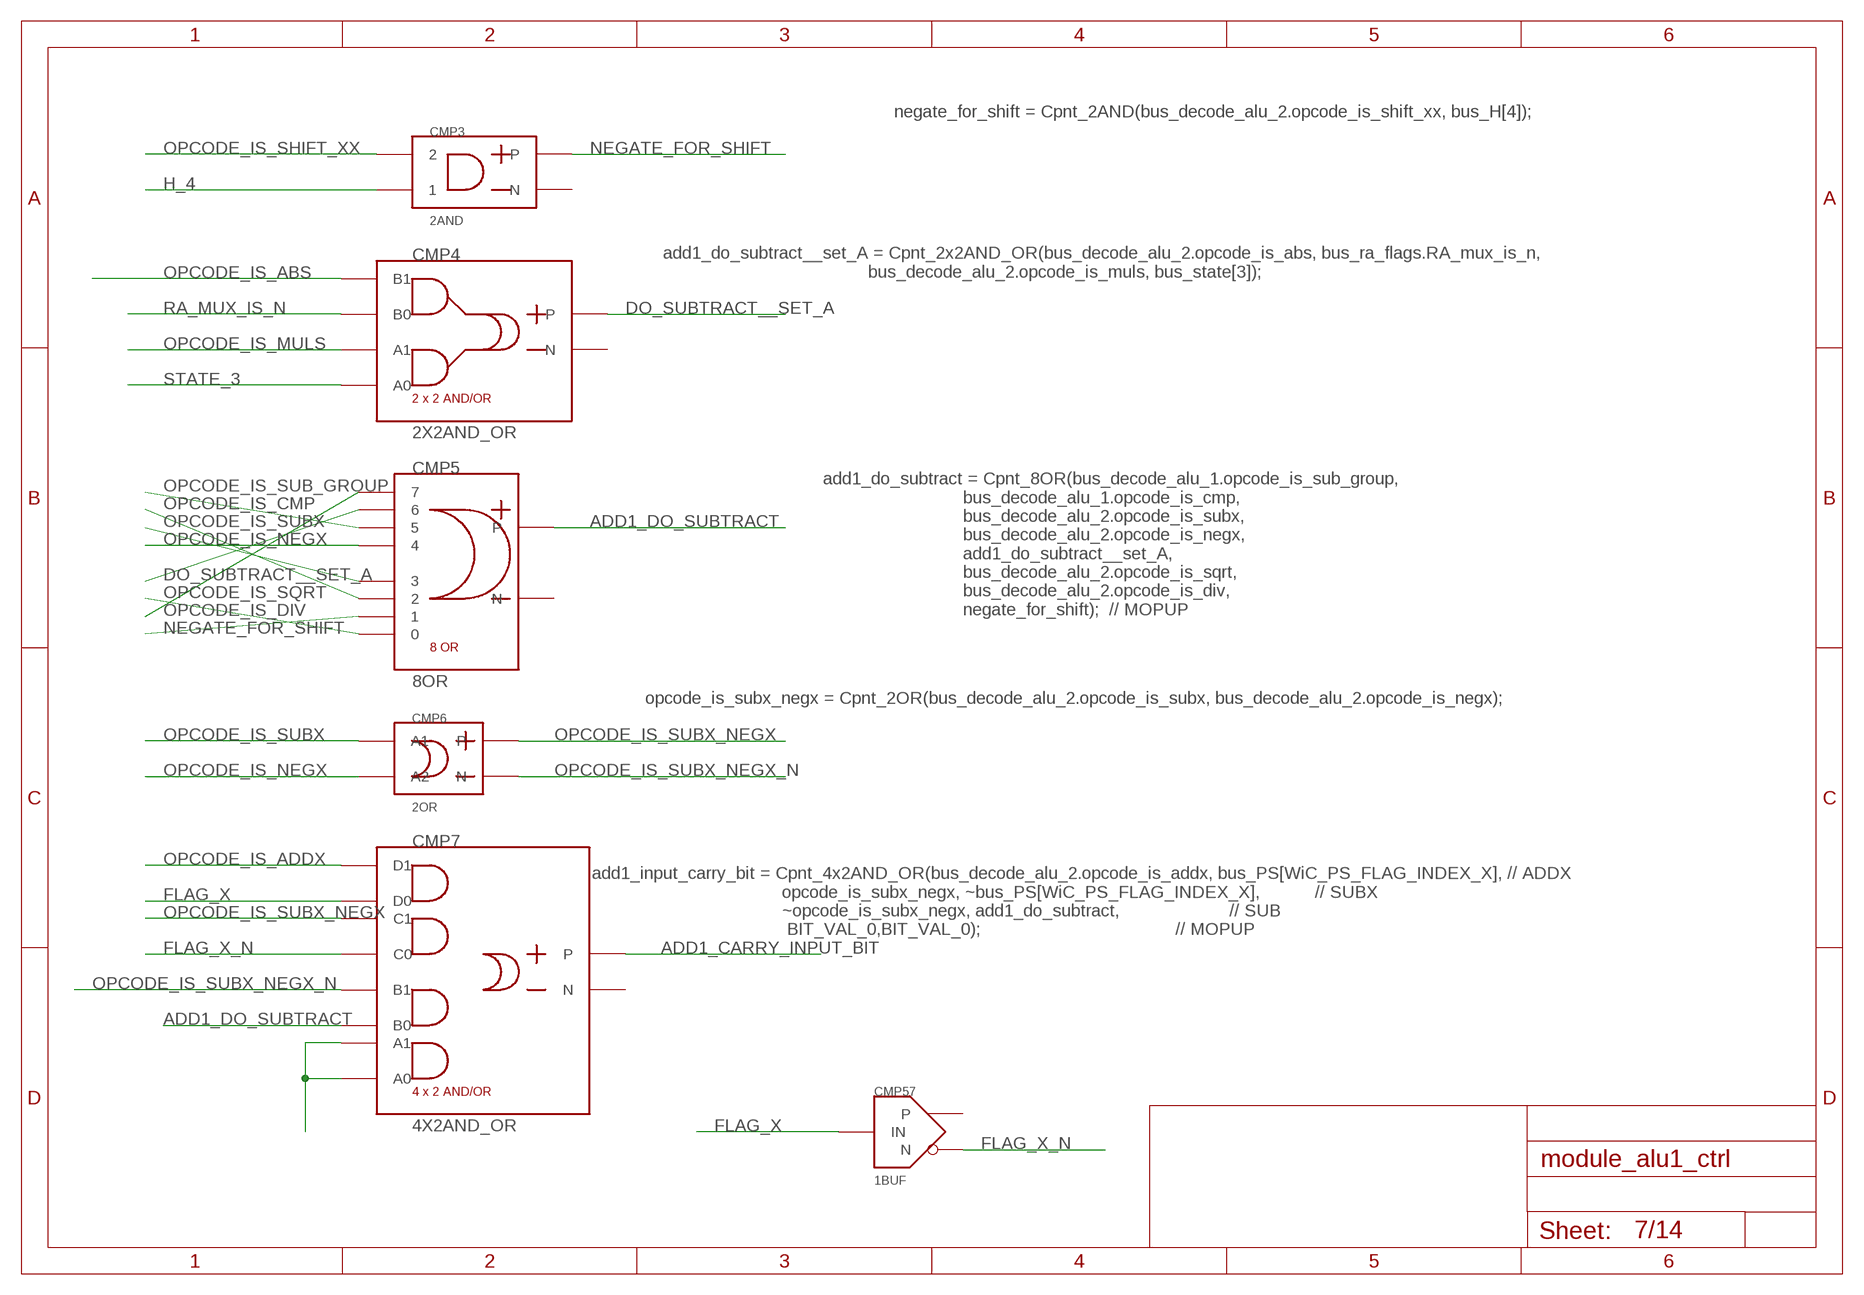
[diagram p6: schematic, sheet 7]

### Parts
CMP3  2AND  [2AND]
CMP4  2X2AND_OR  [2X2AND_OR]
CMP5  8OR  [8OR]
CMP6  2OR  [2OR]
CMP7  4X2AND_OR  [4X2AND_OR]
CMP57  1BUF  [1BUF]

### Nets
ADD1_CARRY_INPUT_BIT: CMP7.OUT_P(P) ; also sheet 14
ADD1_DO_SUBTRACT: CMP5.OUT_P(P) CMP7.P$3(B0) ; also sheet 14
DO_SUBTRACT__SET_A: CMP4.OUT_P(P) CMP5.7
FLAG_X: CMP7.P$7(D0) CMP57.IN ; also sheet 1,9
FLAG_X_N: CMP7.P$5(C0) CMP57.N
H_4: CMP3.P$1 ; also sheet 1,8,14
N$1: CMP7.P$1(A0) CMP7.P$2(A1)
NEGATE_FOR_SHIFT: CMP3.OUT_P(P) CMP5.2
OPCODE_IS_ABS: CMP4.P$4(B1) ; also sheet 3
OPCODE_IS_ADDX: CMP7.P$8(D1) ; also sheet 3,8
OPCODE_IS_CMP: CMP5.3 ; also sheet 3,5,8
OPCODE_IS_DIV: CMP5.8 ; also sheet 3
OPCODE_IS_MULS: CMP4.P$2(A1) ; also sheet 3
OPCODE_IS_NEGX: CMP5.5 CMP6.P$1(A2) ; also sheet 3,8
OPCODE_IS_SHIFT_XX: CMP3.P$2 ; also sheet 3,6,8,11
OPCODE_IS_SQRT: CMP5.1 ; also sheet 3
OPCODE_IS_SUB_GROUP: CMP5.6 ; also sheet 3,6
OPCODE_IS_SUBX: CMP5.4 CMP6.P$2(A1) ; also sheet 3,8
OPCODE_IS_SUBX_NEGX: CMP6.OUT_P(P) CMP7.P$6(C1)
OPCODE_IS_SUBX_NEGX_N: CMP6.OUT_M(N) CMP7.P$4(B1)
RA_MUX_IS_N: CMP4.P$3(B0) ; also sheet 1,9
STATE_3: CMP4.P$1(A0) ; also sheet 2,12
Unconnected: CMP3.OUT_M(N) CMP4.OUT_M(N) CMP5.OUT_M(N) CMP7.OUT_M(N) CMP57.P

### Notes on the sheet
- negate_for_shift = Cpnt_2AND(bus_decode_alu_2.opcode_is_shift_xx, bus_H[4]);
- add1_do_subtract__set_A = Cpnt_2x2AND_OR(bus_decode_alu_2.opcode_is_abs, bus_ra_flags.RA_mux_is_n,
                                               bus_decode_alu_2.opcode_is_muls, bus_state[3]);
- add1_do_subtract = Cpnt_8OR(bus_decode_alu_1.opcode_is_sub_group,
                                  bus_decode_alu_1.opcode_is_cmp,
                                  bus_decode_alu_2.opcode_is_subx,
                                  bus_decode_alu_2.opcode_is_negx,
                                  add1_do_subtract__set_A,
                                  bus_decode_alu_2.opcode_is_sqrt,
                                  bus_decode_alu_2.opcode_is_div,
                                  negate_for_shift);  // MOPUP
- opcode_is_subx_negx = Cpnt_2OR(bus_decode_alu_2.opcode_is_subx, bus_decode_alu_2.opcode_is_negx);
- add1_input_carry_bit = Cpnt_4x2AND_OR(bus_decode_alu_2.opcode_is_addx, bus_PS[WiC_PS_FLAG_INDEX_X], // ADDX
                                            opcode_is_subx_negx, ~bus_PS[WiC_PS_FLAG_INDEX_X],           // SUBX
                                            ~opcode_is_subx_negx, add1_do_subtract,                      // SUB
                                             BIT_VAL_0,BIT_VAL_0);                                       // MOPUP

## Sheet 8 of 14
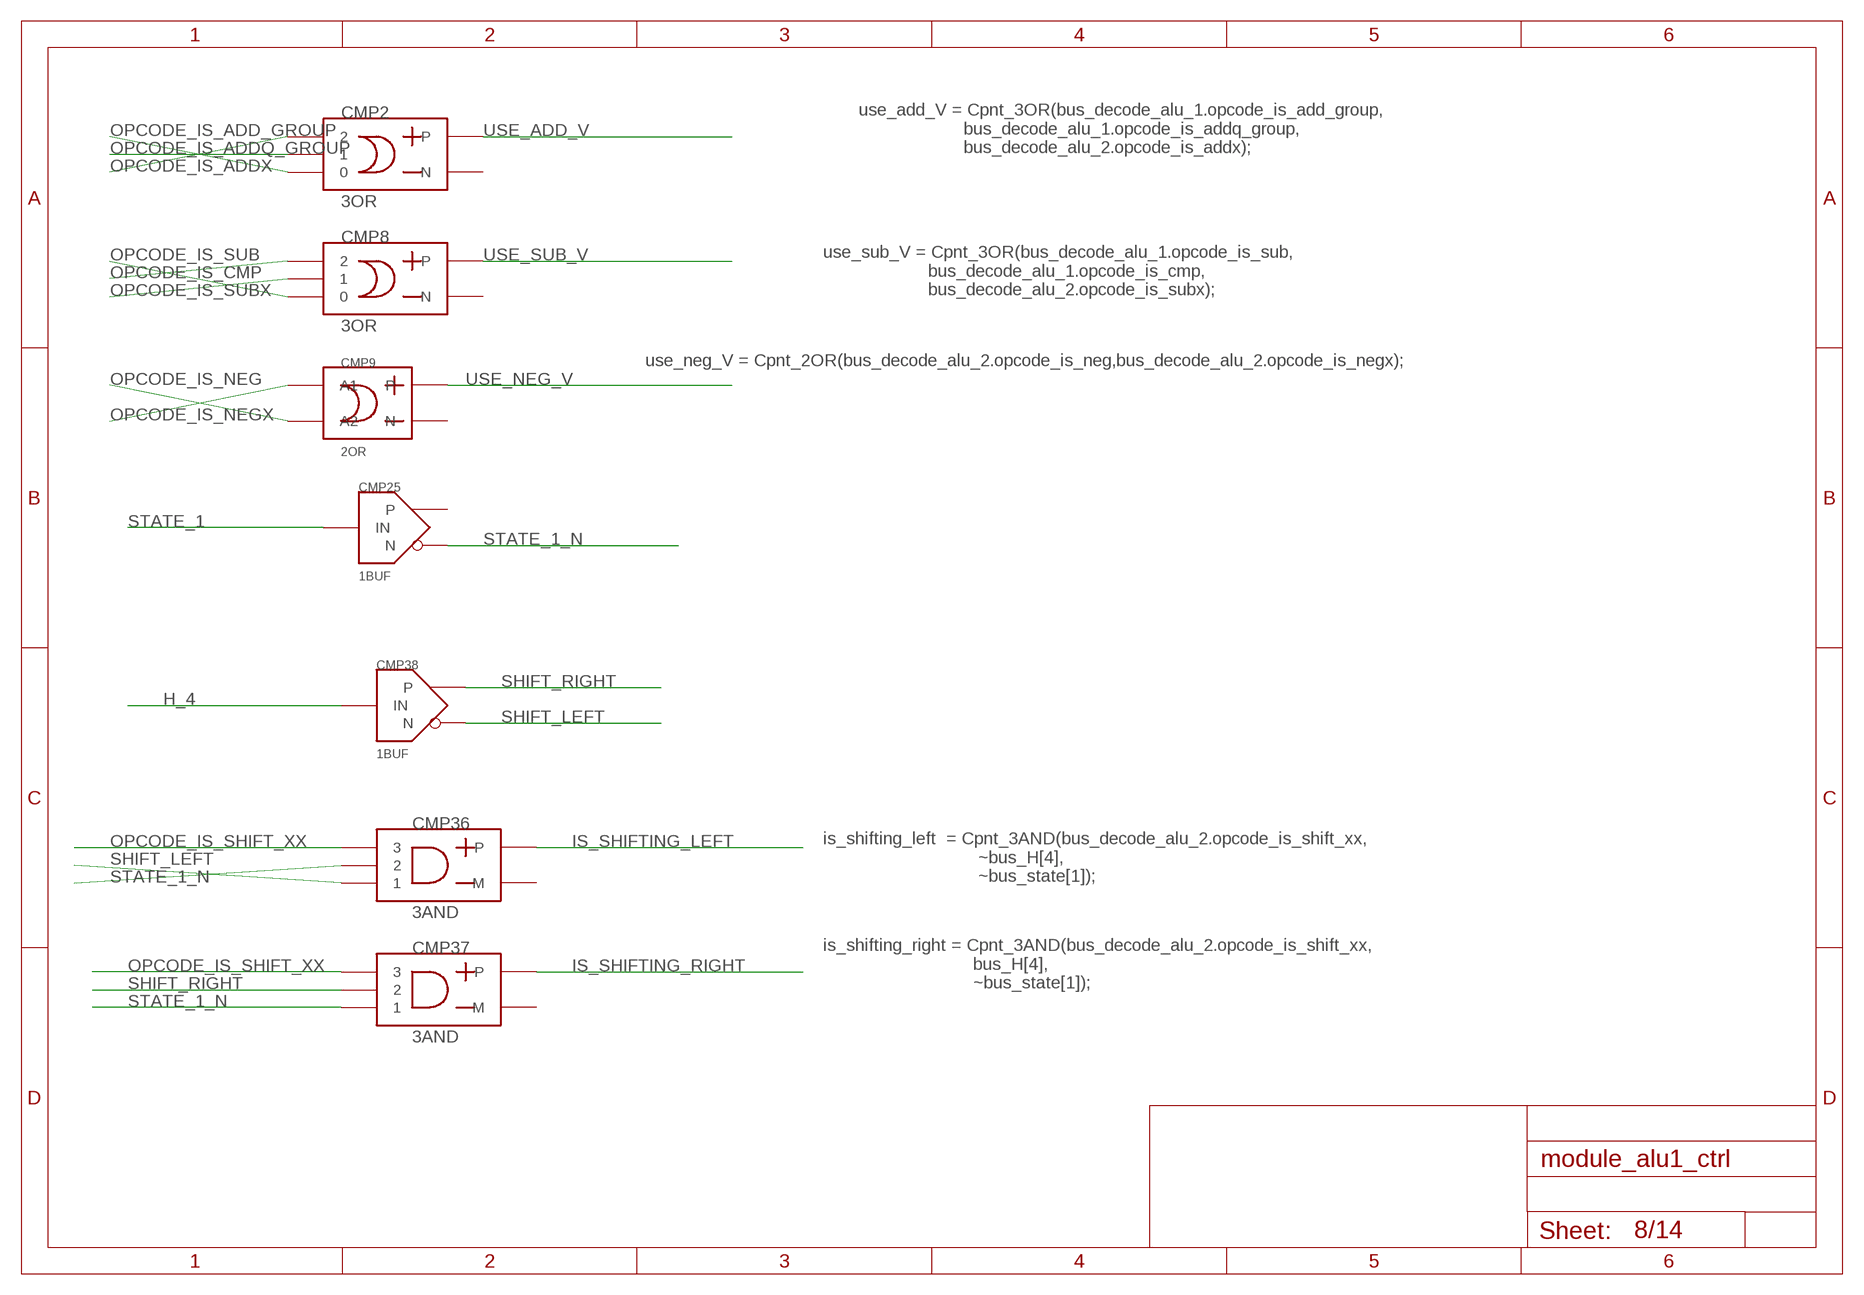
[diagram p7: schematic, sheet 8]

### Parts
CMP2  3OR  [3OR]
CMP8  3OR  [3OR]
CMP9  2OR  [2OR]
CMP25  1BUF  [1BUF]
CMP36  3AND  [3AND]
CMP37  3AND  [3AND]
CMP38  1BUF  [1BUF]

### Nets
H_4: CMP38.IN ; also sheet 1,7,14
IS_SHIFTING_LEFT: CMP36.OUT_P(P) ; also sheet 10,14
IS_SHIFTING_RIGHT: CMP37.OUT_P(P) ; also sheet 10,14
OPCODE_IS_ADD_GROUP: CMP2.P$1 ; also sheet 3,5,6
OPCODE_IS_ADDQ_GROUP: CMP2.P$2 ; also sheet 3,5,6
OPCODE_IS_ADDX: CMP2.P$3 ; also sheet 3,7
OPCODE_IS_CMP: CMP8.P$3 ; also sheet 3,5,7
OPCODE_IS_NEG: CMP9.P$1(A2) ; also sheet 3
OPCODE_IS_NEGX: CMP9.P$2(A1) ; also sheet 3,7
OPCODE_IS_SHIFT_XX: CMP36.P$3 CMP37.P$3 ; also sheet 3,6,7,11
OPCODE_IS_SUB: CMP8.P$1 ; also sheet 3,5
OPCODE_IS_SUBX: CMP8.P$2 ; also sheet 3,7
SHIFT_LEFT: CMP36.P$1 CMP38.N
SHIFT_RIGHT: CMP37.P$2 CMP38.P
STATE_1: CMP25.IN ; also sheet 2,5
STATE_1_N: CMP25.N CMP36.P$2 CMP37.P$1 ; also sheet 10
USE_ADD_V: CMP2.OUT_P(P) ; also sheet 14
USE_NEG_V: CMP9.OUT_P(P) ; also sheet 14
USE_SUB_V: CMP8.OUT_P(P) ; also sheet 14
Unconnected: CMP2.OUT_M(N) CMP8.OUT_M(N) CMP9.OUT_M(N) CMP25.P CMP36.OUT_M(M) CMP37.OUT_M(M)

### Notes on the sheet
- use_add_V = Cpnt_3OR(bus_decode_alu_1.opcode_is_add_group,
                           bus_decode_alu_1.opcode_is_addq_group,
                           bus_decode_alu_2.opcode_is_addx);
- use_sub_V = Cpnt_3OR(bus_decode_alu_1.opcode_is_sub,
                           bus_decode_alu_1.opcode_is_cmp,
                           bus_decode_alu_2.opcode_is_subx);
- use_neg_V = Cpnt_2OR(bus_decode_alu_2.opcode_is_neg,bus_decode_alu_2.opcode_is_negx);
- is_shifting_left  = Cpnt_3AND(bus_decode_alu_2.opcode_is_shift_xx,
                                     ~bus_H[4],
                                     ~bus_state[1]);
- is_shifting_right = Cpnt_3AND(bus_decode_alu_2.opcode_is_shift_xx,
                                    bus_H[4],
                                    ~bus_state[1]);

## Sheet 9 of 14
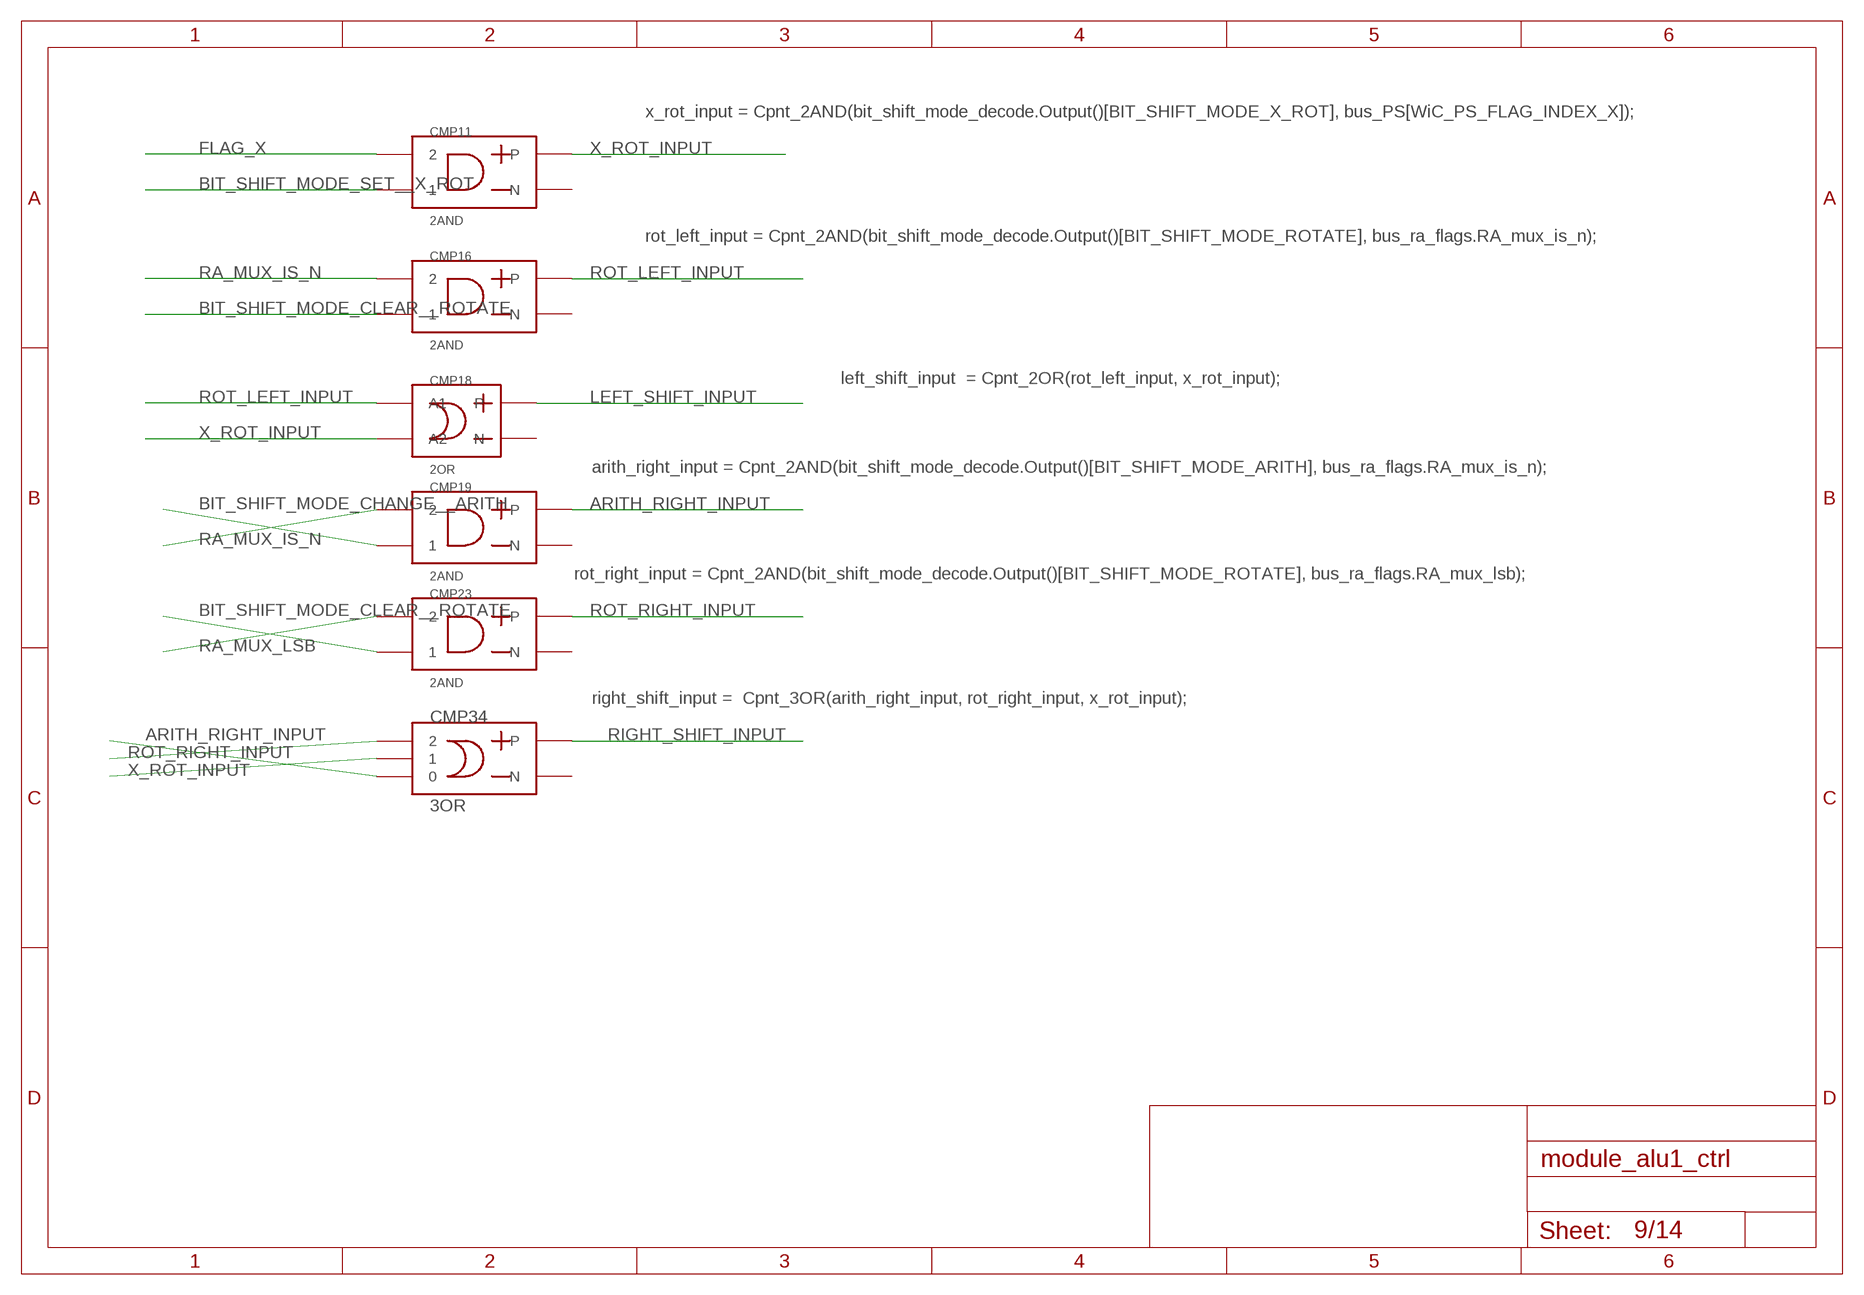
[diagram p8: schematic, sheet 9]

### Parts
CMP11  2AND  [2AND]
CMP16  2AND  [2AND]
CMP18  2OR  [2OR]
CMP19  2AND  [2AND]
CMP23  2AND  [2AND]
CMP34  3OR  [3OR]

### Nets
ARITH_RIGHT_INPUT: CMP19.OUT_P(P) CMP34.P$1
BIT_SHIFT_MODE_CHANGE__ARITH: CMP19.P$1 ; also sheet 5
BIT_SHIFT_MODE_CLEAR__ROTATE: CMP16.P$1 CMP23.P$1 ; also sheet 5,6,10
BIT_SHIFT_MODE_SET__X_ROT: CMP11.P$1 ; also sheet 5,10
FLAG_X: CMP11.P$2 ; also sheet 1,7
LEFT_SHIFT_INPUT: CMP18.OUT_P(P) ; also sheet 14
RA_MUX_IS_N: CMP16.P$2 CMP19.P$2 ; also sheet 1,7
RA_MUX_LSB: CMP23.P$2 ; also sheet 1,13
RIGHT_SHIFT_INPUT: CMP34.OUT_P(P) ; also sheet 14
ROT_LEFT_INPUT: CMP16.OUT_P(P) CMP18.P$2(A1)
ROT_RIGHT_INPUT: CMP23.OUT_P(P) CMP34.P$3
X_ROT_INPUT: CMP11.OUT_P(P) CMP18.P$1(A2) CMP34.P$2
Unconnected: CMP11.OUT_M(N) CMP16.OUT_M(N) CMP18.OUT_M(N) CMP19.OUT_M(N) CMP23.OUT_M(N) CMP34.OUT_M(N)

### Notes on the sheet
- x_rot_input = Cpnt_2AND(bit_shift_mode_decode.Output()[BIT_SHIFT_MODE_X_ROT], bus_PS[WiC_PS_FLAG_INDEX_X]);
- rot_left_input = Cpnt_2AND(bit_shift_mode_decode.Output()[BIT_SHIFT_MODE_ROTATE], bus_ra_flags.RA_mux_is_n);
- left_shift_input  = Cpnt_2OR(rot_left_input, x_rot_input);
- arith_right_input = Cpnt_2AND(bit_shift_mode_decode.Output()[BIT_SHIFT_MODE_ARITH], bus_ra_flags.RA_mux_is_n);
- rot_right_input = Cpnt_2AND(bit_shift_mode_decode.Output()[BIT_SHIFT_MODE_ROTATE], bus_ra_flags.RA_mux_lsb);
- right_shift_input =  Cpnt_3OR(arith_right_input, rot_right_input, x_rot_input);

## Sheet 10 of 14
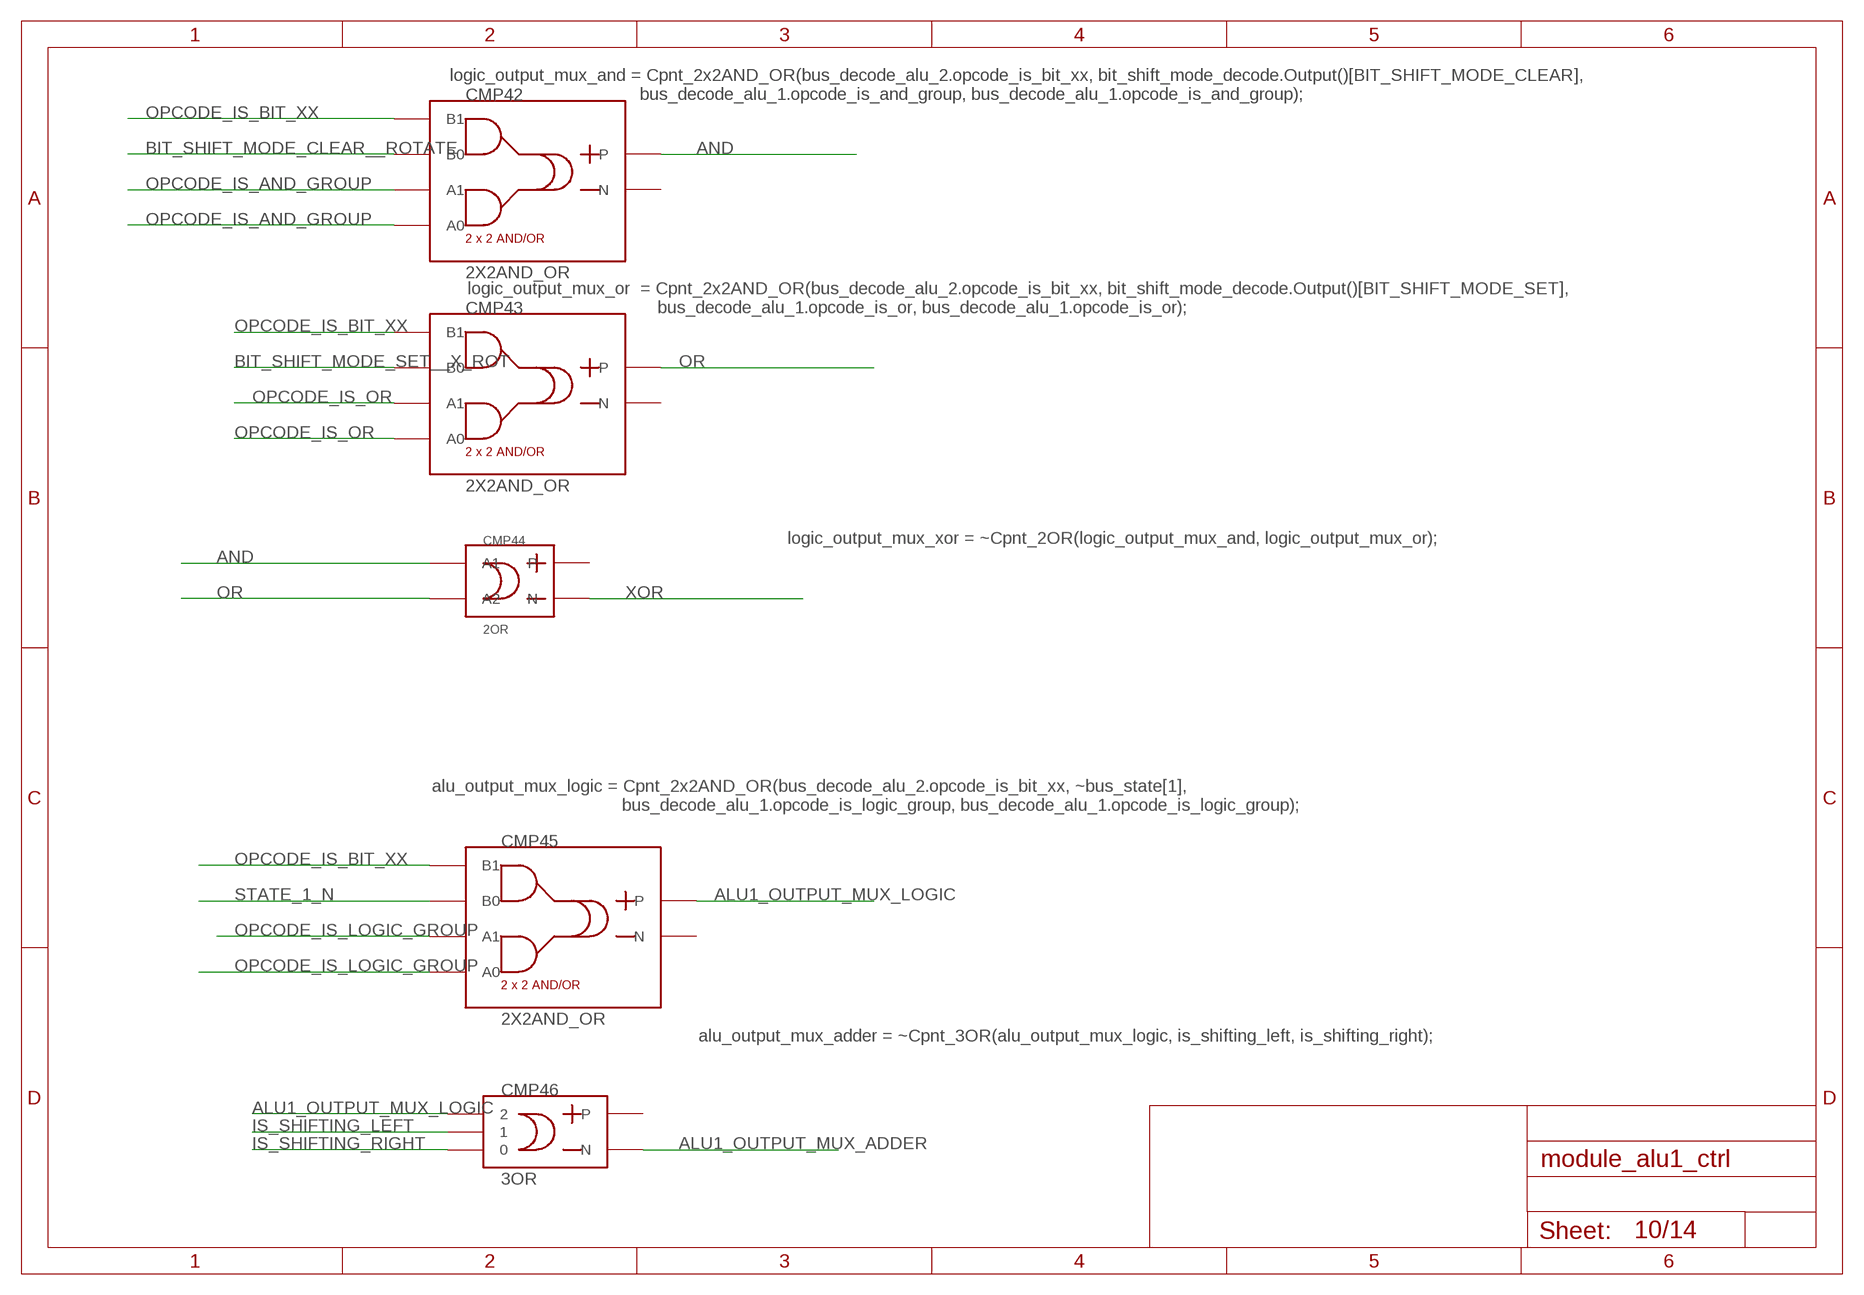
[diagram p9: schematic, sheet 10]

### Parts
CMP42  2X2AND_OR  [2X2AND_OR]
CMP43  2X2AND_OR  [2X2AND_OR]
CMP44  2OR  [2OR]
CMP45  2X2AND_OR  [2X2AND_OR]
CMP46  3OR  [3OR]

### Nets
ALU1_OUTPUT_MUX_ADDER: CMP46.OUT_M(N) ; also sheet 14
ALU1_OUTPUT_MUX_LOGIC: CMP45.OUT_P(P) CMP46.P$3 ; also sheet 14
AND: CMP42.OUT_P(P) CMP44.P$2(A1) ; also sheet 14
BIT_SHIFT_MODE_CLEAR__ROTATE: CMP42.P$3(B0) ; also sheet 5,6,9
BIT_SHIFT_MODE_SET__X_ROT: CMP43.P$3(B0) ; also sheet 5,9
IS_SHIFTING_LEFT: CMP46.P$2 ; also sheet 8,14
IS_SHIFTING_RIGHT: CMP46.P$1 ; also sheet 8,14
OPCODE_IS_AND_GROUP: CMP42.P$1(A0) CMP42.P$2(A1) ; also sheet 3,5,6
OPCODE_IS_BIT_XX: CMP42.P$4(B1) CMP43.P$4(B1) CMP45.P$4(B1) ; also sheet 3,5
OPCODE_IS_LOGIC_GROUP: CMP45.P$1(A0) CMP45.P$2(A1) ; also sheet 3
OPCODE_IS_OR: CMP43.P$1(A0) CMP43.P$2(A1) ; also sheet 3,6
OR: CMP43.OUT_P(P) CMP44.P$1(A2) ; also sheet 14
STATE_1_N: CMP45.P$3(B0) ; also sheet 8
XOR: CMP44.OUT_M(N) ; also sheet 14
Unconnected: CMP42.OUT_M(N) CMP43.OUT_M(N) CMP44.OUT_P(P) CMP45.OUT_M(N) CMP46.OUT_P(P)

### Notes on the sheet
- logic_output_mux_and = Cpnt_2x2AND_OR(bus_decode_alu_2.opcode_is_bit_xx, bit_shift_mode_decode.Output()[BIT_SHIFT_MODE_CLEAR],
                                            bus_decode_alu_1.opcode_is_and_group, bus_decode_alu_1.opcode_is_and_group);
- logic_output_mux_or  = Cpnt_2x2AND_OR(bus_decode_alu_2.opcode_is_bit_xx, bit_shift_mode_decode.Output()[BIT_SHIFT_MODE_SET],
                                            bus_decode_alu_1.opcode_is_or, bus_decode_alu_1.opcode_is_or);
- logic_output_mux_xor = ~Cpnt_2OR(logic_output_mux_and, logic_output_mux_or);
- alu_output_mux_logic = Cpnt_2x2AND_OR(bus_decode_alu_2.opcode_is_bit_xx, ~bus_state[1],
                                            bus_decode_alu_1.opcode_is_logic_group, bus_decode_alu_1.opcode_is_logic_group);
- alu_output_mux_adder = ~Cpnt_3OR(alu_output_mux_logic, is_shifting_left, is_shifting_right);

## Sheet 11 of 14
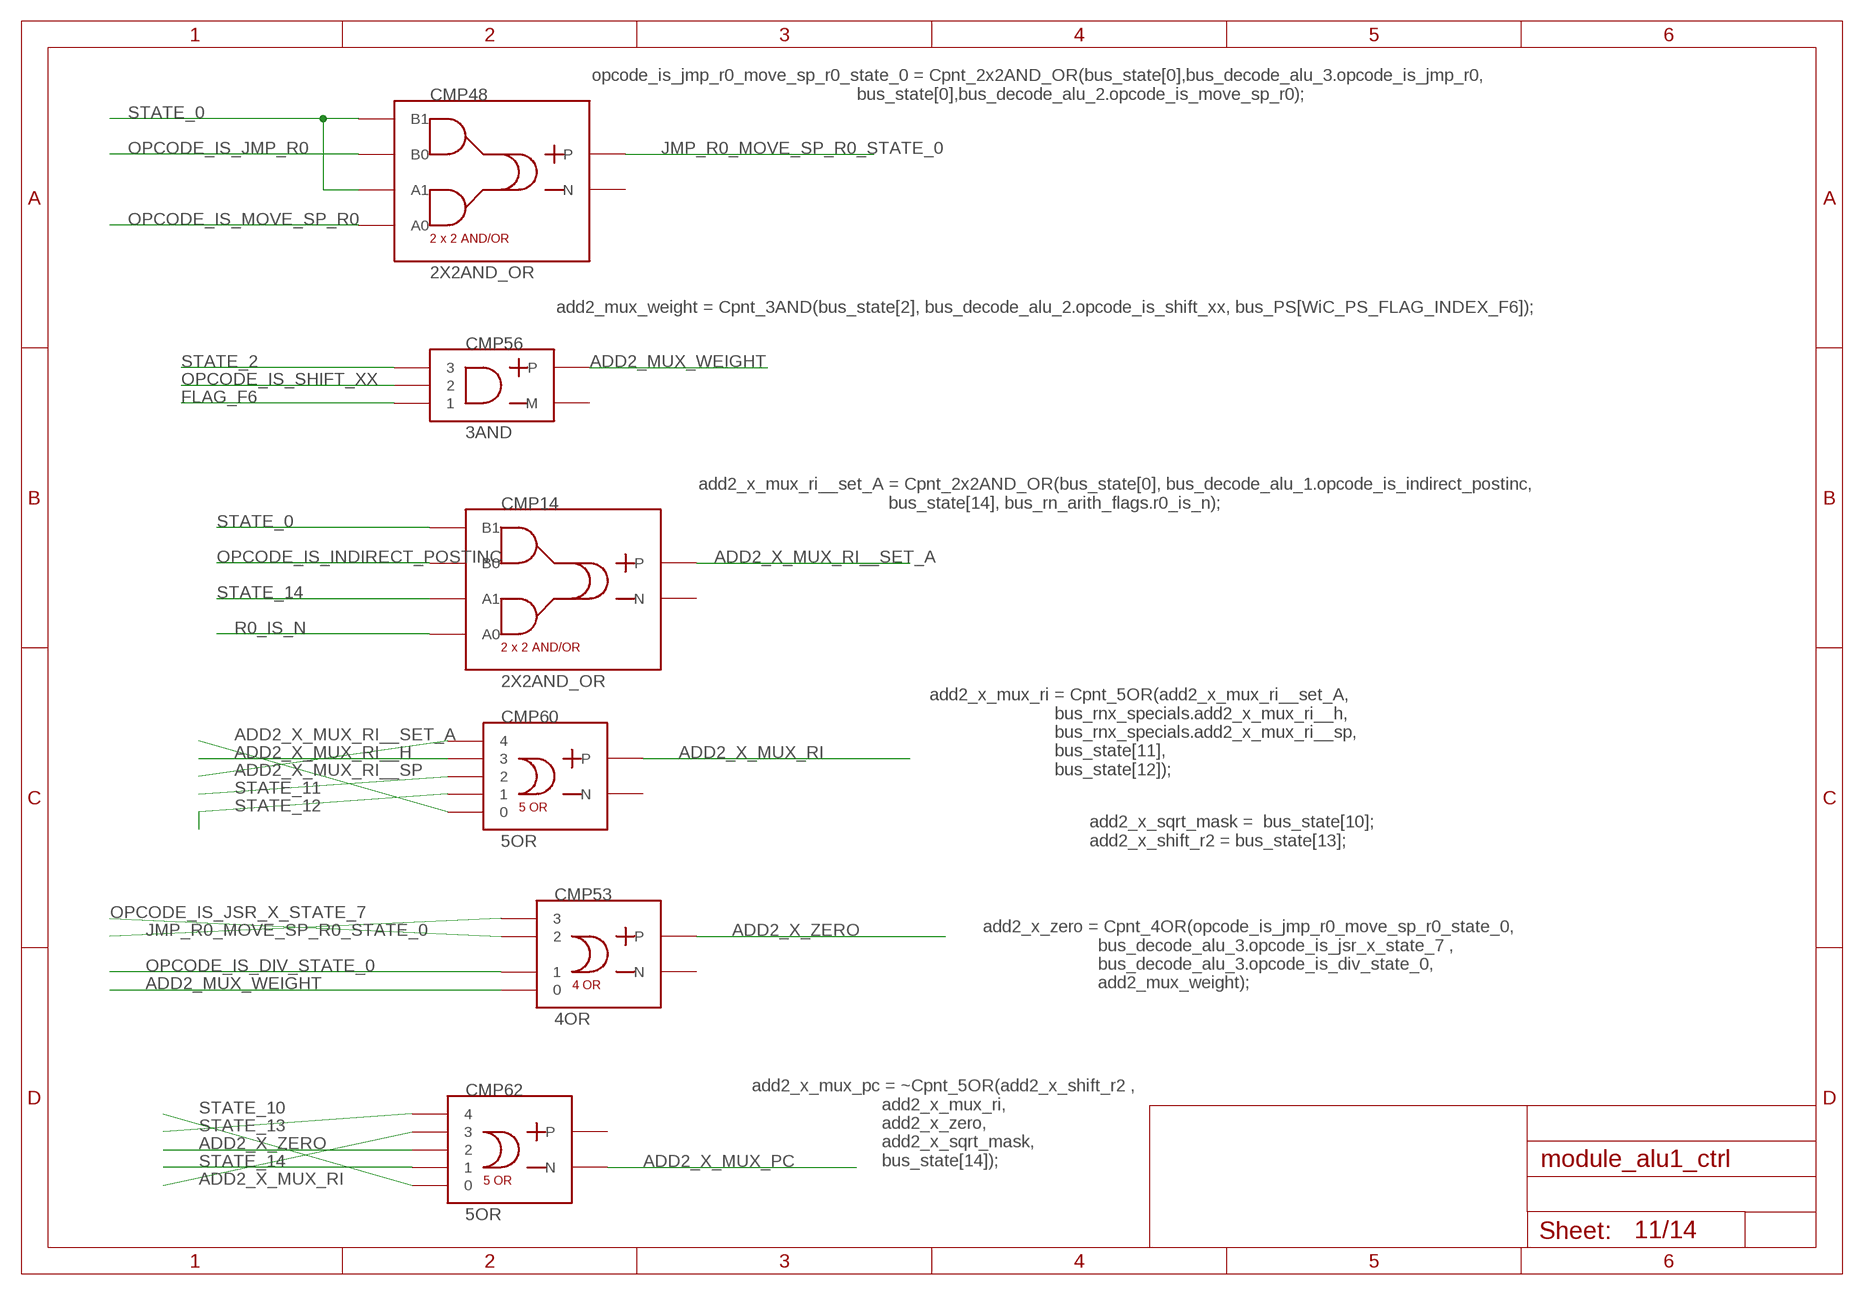
[diagram p10: schematic, sheet 11]

### Parts
CMP14  2X2AND_OR  [2X2AND_OR]
CMP48  2X2AND_OR  [2X2AND_OR]
CMP53  4OR  [4OR]
CMP56  3AND  [3AND]
CMP60  5OR  [5OR]
CMP62  5OR  [5OR]

### Nets
ADD2_MUX_WEIGHT: CMP53.1 CMP56.OUT_P(P) ; also sheet 13,14
ADD2_X_MUX_PC: CMP62.OUT_M(N) ; also sheet 14
ADD2_X_MUX_RI: CMP60.OUT_P(P) CMP62.4 ; also sheet 14
ADD2_X_MUX_RI__H: CMP60.4 ; also sheet 2
ADD2_X_MUX_RI__SET_A: CMP14.OUT_P(P) CMP60.1
ADD2_X_MUX_RI__SP: CMP60.5 ; also sheet 2
ADD2_X_ZERO: CMP53.OUT_P(P) CMP62.3
FLAG_F6: CMP56.P$1 ; also sheet 1
JMP_R0_MOVE_SP_R0_STATE_0: CMP48.OUT_P(P) CMP53.4 ; also sheet 12
OPCODE_IS_DIV_STATE_0: CMP53.2 ; also sheet 3,12
OPCODE_IS_INDIRECT_POSTINC: CMP14.P$3(B0) ; also sheet 3
OPCODE_IS_JMP_R0: CMP48.P$3(B0) ; also sheet 3
OPCODE_IS_JSR_X_STATE_7: CMP53.3 ; also sheet 3
OPCODE_IS_MOVE_SP_R0: CMP48.P$1(A0) ; also sheet 3
OPCODE_IS_SHIFT_XX: CMP56.P$2 ; also sheet 3,6,7,8
R0_IS_N: CMP14.P$1(A0) ; also sheet 2,13
STATE_0: CMP14.P$4(B1) CMP48.P$2(A1) CMP48.P$4(B1) ; also sheet 2,13
STATE_2: CMP56.P$3 ; also sheet 2
STATE_10: CMP62.1 ; also sheet 2,12,14
STATE_11: CMP60.3 ; also sheet 2,5
STATE_12: CMP60.2 ; also sheet 2
STATE_13: CMP62.5 ; also sheet 2,5,6,12,14
STATE_14: CMP14.P$2(A1) CMP62.2 ; also sheet 2,12,13
Unconnected: CMP14.OUT_M(N) CMP48.OUT_M(N) CMP53.OUT_M(N) CMP56.OUT_M(M) CMP60.OUT_M(N) CMP62.OUT_P(P)

### Notes on the sheet
- opcode_is_jmp_r0_move_sp_r0_state_0 = Cpnt_2x2AND_OR(bus_state[0],bus_decode_alu_3.opcode_is_jmp_r0,
                                                           bus_state[0],bus_decode_alu_2.opcode_is_move_sp_r0);
- add2_mux_weight = Cpnt_3AND(bus_state[2], bus_decode_alu_2.opcode_is_shift_xx, bus_PS[WiC_PS_FLAG_INDEX_F6]);
- add2_x_mux_ri__set_A = Cpnt_2x2AND_OR(bus_state[0], bus_decode_alu_1.opcode_is_indirect_postinc,
                                            bus_state[14], bus_rn_arith_flags.r0_is_n);
- add2_x_mux_ri = Cpnt_5OR(add2_x_mux_ri__set_A,
                               bus_rnx_specials.add2_x_mux_ri__h,
                               bus_rnx_specials.add2_x_mux_ri__sp,
                               bus_state[11],
                               bus_state[12]);
- add2_x_sqrt_mask =  bus_state[10];
      add2_x_shift_r2 = bus_state[13];
- add2_x_zero = Cpnt_4OR(opcode_is_jmp_r0_move_sp_r0_state_0,
                             bus_decode_alu_3.opcode_is_jsr_x_state_7 ,
                             bus_decode_alu_3.opcode_is_div_state_0,
                             add2_mux_weight);
- add2_x_mux_pc = ~Cpnt_5OR(add2_x_shift_r2 ,
                                add2_x_mux_ri,
                                add2_x_zero,
                                add2_x_sqrt_mask,
                                bus_state[14]);

## Sheet 12 of 14
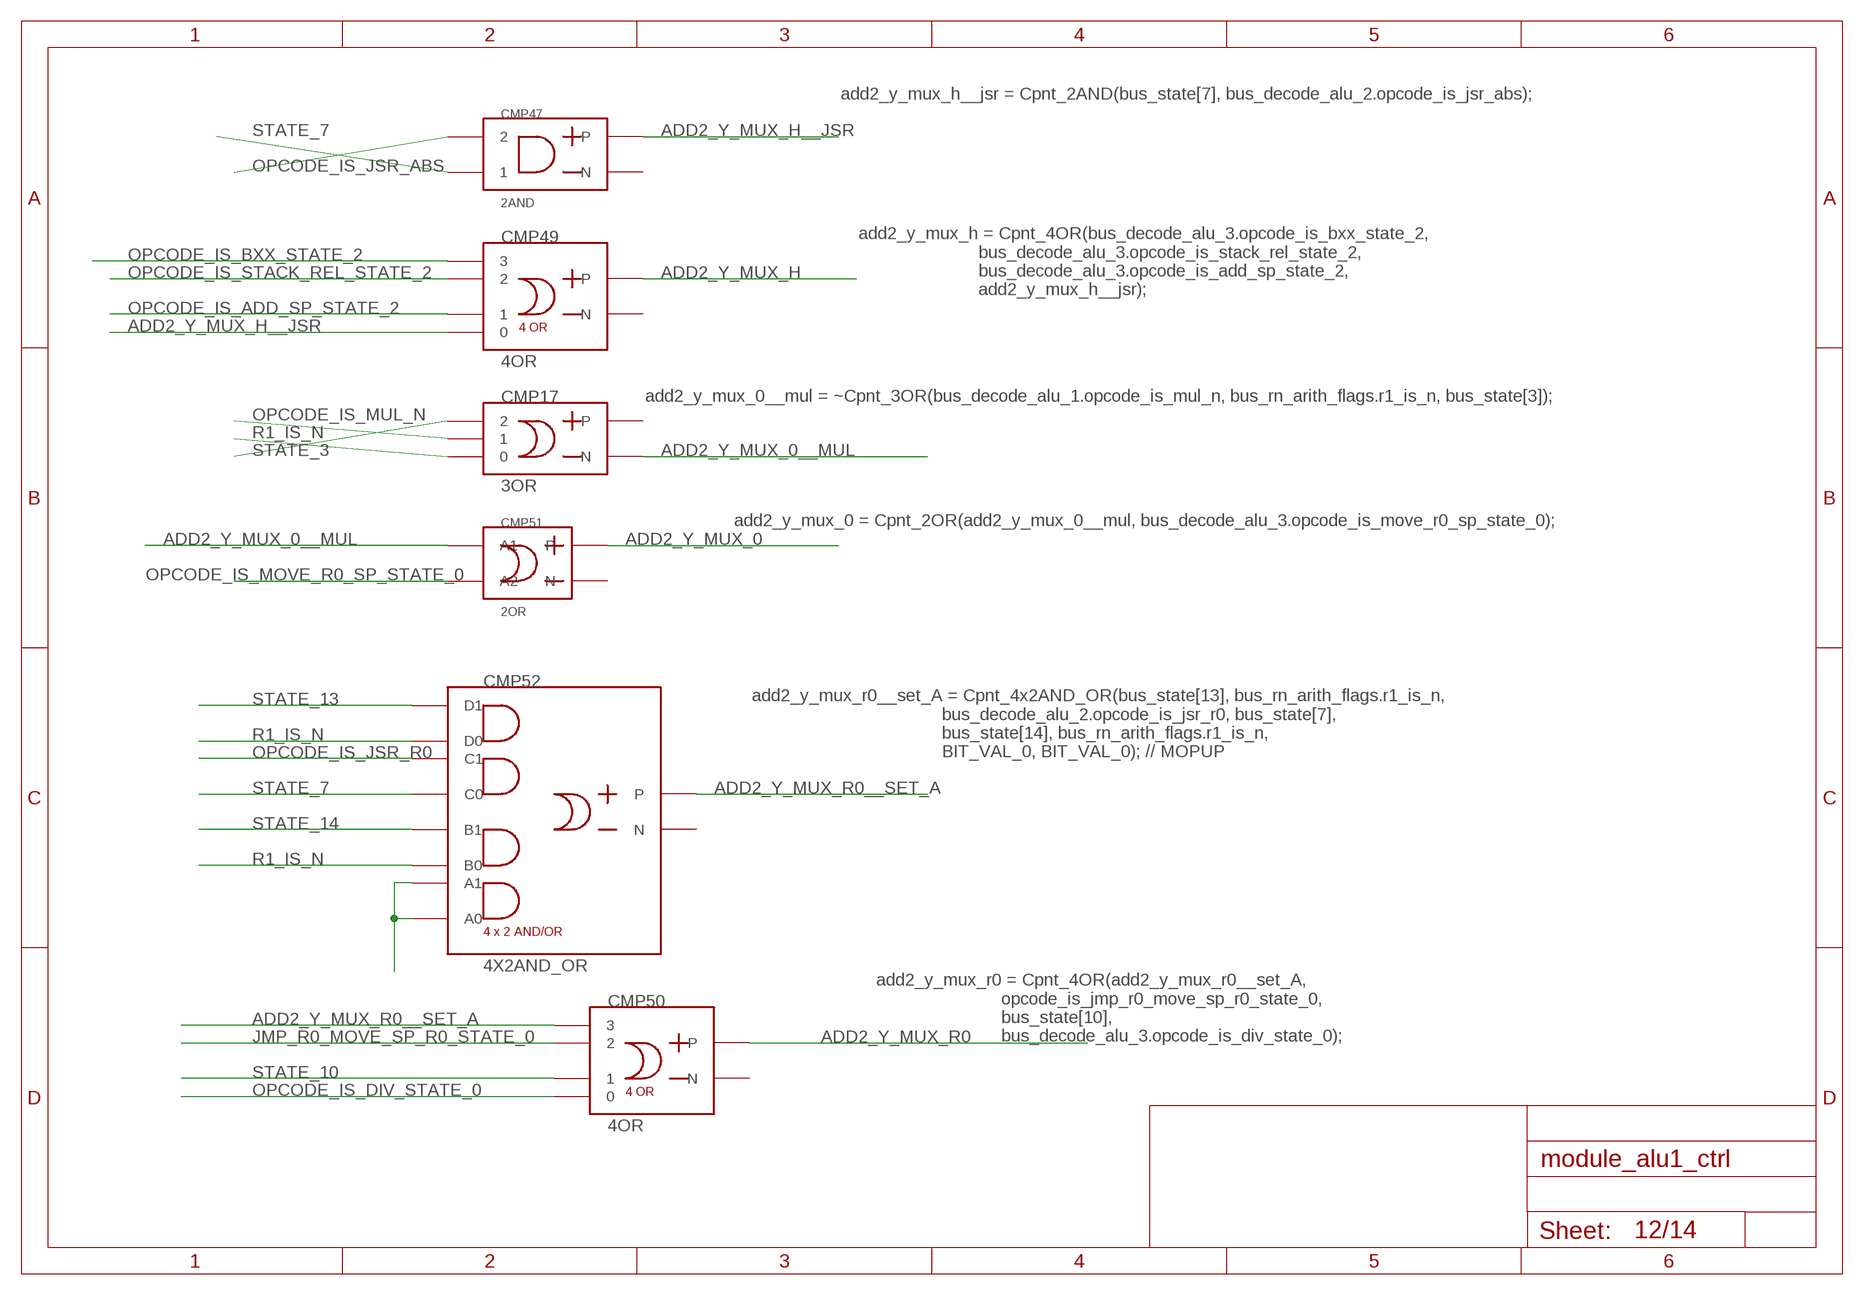
[diagram p11: schematic, sheet 12]

### Parts
CMP17  3OR  [3OR]
CMP47  2AND  [2AND]
CMP49  4OR  [4OR]
CMP50  4OR  [4OR]
CMP51  2OR  [2OR]
CMP52  4X2AND_OR  [4X2AND_OR]

### Nets
ADD2_Y_MUX_0: CMP51.OUT_P(P) ; also sheet 13
ADD2_Y_MUX_0__MUL: CMP17.OUT_M(N) CMP51.P$2(A1)
ADD2_Y_MUX_H: CMP49.OUT_P(P) ; also sheet 13,14
ADD2_Y_MUX_H__JSR: CMP47.OUT_P(P) CMP49.1
ADD2_Y_MUX_R0: CMP50.OUT_P(P) ; also sheet 13,14
ADD2_Y_MUX_R0__SET_A: CMP50.4 CMP52.OUT_P(P)
JMP_R0_MOVE_SP_R0_STATE_0: CMP50.3 ; also sheet 11
N$32: CMP52.P$1(A0) CMP52.P$2(A1)
OPCODE_IS_ADD_SP_STATE_2: CMP49.2 ; also sheet 3
OPCODE_IS_BXX_STATE_2: CMP49.4 ; also sheet 3
OPCODE_IS_DIV_STATE_0: CMP50.1 ; also sheet 3,11
OPCODE_IS_JSR_ABS: CMP47.P$2 ; also sheet 3
OPCODE_IS_JSR_R0: CMP52.P$6(C1) ; also sheet 3,13
OPCODE_IS_MOVE_R0_SP_STATE_0: CMP51.P$1(A2) ; also sheet 3
OPCODE_IS_MUL_N: CMP17.P$2 ; also sheet 3
OPCODE_IS_STACK_REL_STATE_2: CMP49.3 ; also sheet 3
R1_IS_N: CMP17.P$1 CMP52.P$3(B0) CMP52.P$7(D0) ; also sheet 2
STATE_3: CMP17.P$3 ; also sheet 2,7
STATE_7: CMP47.P$1 CMP52.P$5(C0) ; also sheet 2,13
STATE_10: CMP50.2 ; also sheet 2,11,14
STATE_13: CMP52.P$8(D1) ; also sheet 2,5,6,11,14
STATE_14: CMP52.P$4(B1) ; also sheet 2,11,13
Unconnected: CMP17.OUT_P(P) CMP47.OUT_M(N) CMP49.OUT_M(N) CMP50.OUT_M(N) CMP51.OUT_M(N) CMP52.OUT_M(N)

### Notes on the sheet
- add2_y_mux_h__jsr = Cpnt_2AND(bus_state[7], bus_decode_alu_2.opcode_is_jsr_abs);
- add2_y_mux_h = Cpnt_4OR(bus_decode_alu_3.opcode_is_bxx_state_2,
                              bus_decode_alu_3.opcode_is_stack_rel_state_2,
                              bus_decode_alu_3.opcode_is_add_sp_state_2,
                              add2_y_mux_h__jsr);
- add2_y_mux_0__mul = ~Cpnt_3OR(bus_decode_alu_1.opcode_is_mul_n, bus_rn_arith_flags.r1_is_n, bus_state[3]);
- add2_y_mux_0 = Cpnt_2OR(add2_y_mux_0__mul, bus_decode_alu_3.opcode_is_move_r0_sp_state_0);
- add2_y_mux_r0__set_A = Cpnt_4x2AND_OR(bus_state[13], bus_rn_arith_flags.r1_is_n,
                                            bus_decode_alu_2.opcode_is_jsr_r0, bus_state[7],
                                            bus_state[14], bus_rn_arith_flags.r1_is_n,
                                            BIT_VAL_0, BIT_VAL_0); // MOPUP
- add2_y_mux_r0 = Cpnt_4OR(add2_y_mux_r0__set_A,
                               opcode_is_jmp_r0_move_sp_r0_state_0,
                               bus_state[10],
                               bus_decode_alu_3.opcode_is_div_state_0);

## Sheet 13 of 14
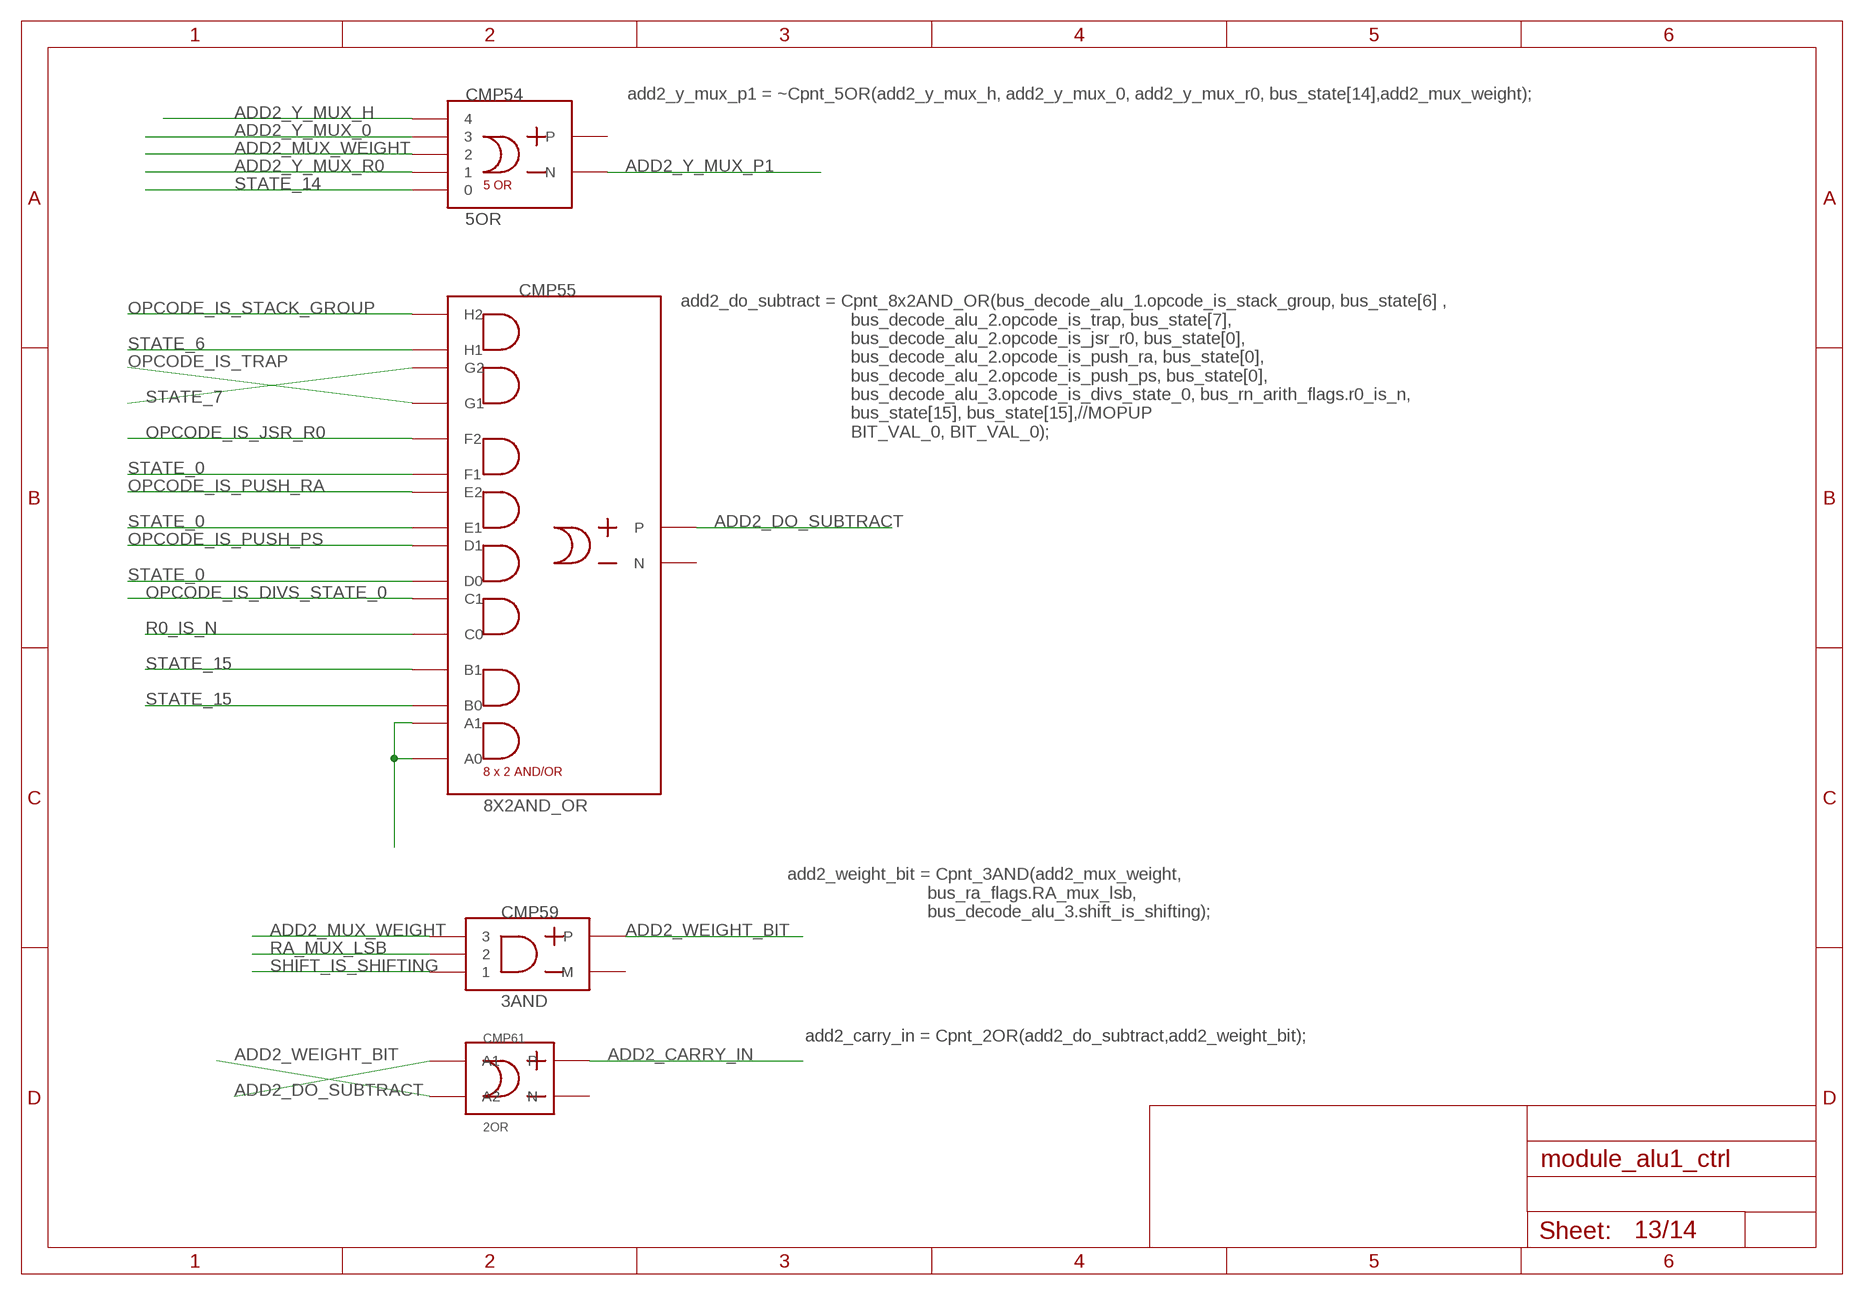
[diagram p12: schematic, sheet 13]

### Parts
CMP54  5OR  [5OR]
CMP55  8X2AND_OR  [8X2AND_OR]
CMP59  3AND  [3AND]
CMP61  2OR  [2OR]

### Nets
ADD2_CARRY_IN: CMP61.OUT_P(P) ; also sheet 14
ADD2_DO_SUBTRACT: CMP55.OUT_P(P) CMP61.P$2(A1) ; also sheet 14
ADD2_MUX_WEIGHT: CMP54.3 CMP59.P$3 ; also sheet 11,14
ADD2_WEIGHT_BIT: CMP59.OUT_P(P) CMP61.P$1(A2)
ADD2_Y_MUX_0: CMP54.4 ; also sheet 12
ADD2_Y_MUX_H: CMP54.5 ; also sheet 12,14
ADD2_Y_MUX_P1: CMP54.OUT_M(N) ; also sheet 14
ADD2_Y_MUX_R0: CMP54.2 ; also sheet 12,14
N$31: CMP55.P$1(A0) CMP55.P$2(A1)
OPCODE_IS_DIVS_STATE_0: CMP55.P$6(C1) ; also sheet 3
OPCODE_IS_JSR_R0: CMP55.P$12(F2) ; also sheet 3,12
OPCODE_IS_PUSH_PS: CMP55.P$8(D1) ; also sheet 3
OPCODE_IS_PUSH_RA: CMP55.P$10(E2) ; also sheet 3
OPCODE_IS_STACK_GROUP: CMP55.P$16(H2) ; also sheet 3,6
OPCODE_IS_TRAP: CMP55.P$13(G1) ; also sheet 3
R0_IS_N: CMP55.P$5(C0) ; also sheet 2,11
RA_MUX_LSB: CMP59.P$2 ; also sheet 1,9
SHIFT_IS_SHIFTING: CMP59.P$1 ; also sheet 3
STATE_0: CMP55.P$7(D0) CMP55.P$9(E1) CMP55.P$11(F1) ; also sheet 2,11
STATE_6: CMP55.P$15(H1) ; also sheet 2
STATE_7: CMP55.P$14(G2) ; also sheet 2,12
STATE_14: CMP54.1 ; also sheet 2,11,12
STATE_15: CMP55.P$3(B0) CMP55.P$4(B1) ; also sheet 2
Unconnected: CMP54.OUT_P(P) CMP55.OUT_M(N) CMP59.OUT_M(M) CMP61.OUT_M(N)

### Notes on the sheet
- add2_y_mux_p1 = ~Cpnt_5OR(add2_y_mux_h, add2_y_mux_0, add2_y_mux_r0, bus_state[14],add2_mux_weight);
- add2_do_subtract = Cpnt_8x2AND_OR(bus_decode_alu_1.opcode_is_stack_group, bus_state[6] ,
                                        bus_decode_alu_2.opcode_is_trap, bus_state[7],
                                        bus_decode_alu_2.opcode_is_jsr_r0, bus_state[0],
                                        bus_decode_alu_2.opcode_is_push_ra, bus_state[0],
                                        bus_decode_alu_2.opcode_is_push_ps, bus_state[0],
                                        bus_decode_alu_3.opcode_is_divs_state_0, bus_rn_arith_flags.r0_is_n,
                                        bus_state[15], bus_state[15],//MOPUP
                                        BIT_VAL_0, BIT_VAL_0);
- add2_weight_bit = Cpnt_3AND(add2_mux_weight,
                                  bus_ra_flags.RA_mux_lsb,
                                  bus_decode_alu_3.shift_is_shifting);
- add2_carry_in = Cpnt_2OR(add2_do_subtract,add2_weight_bit);

## Sheet 14 of 14
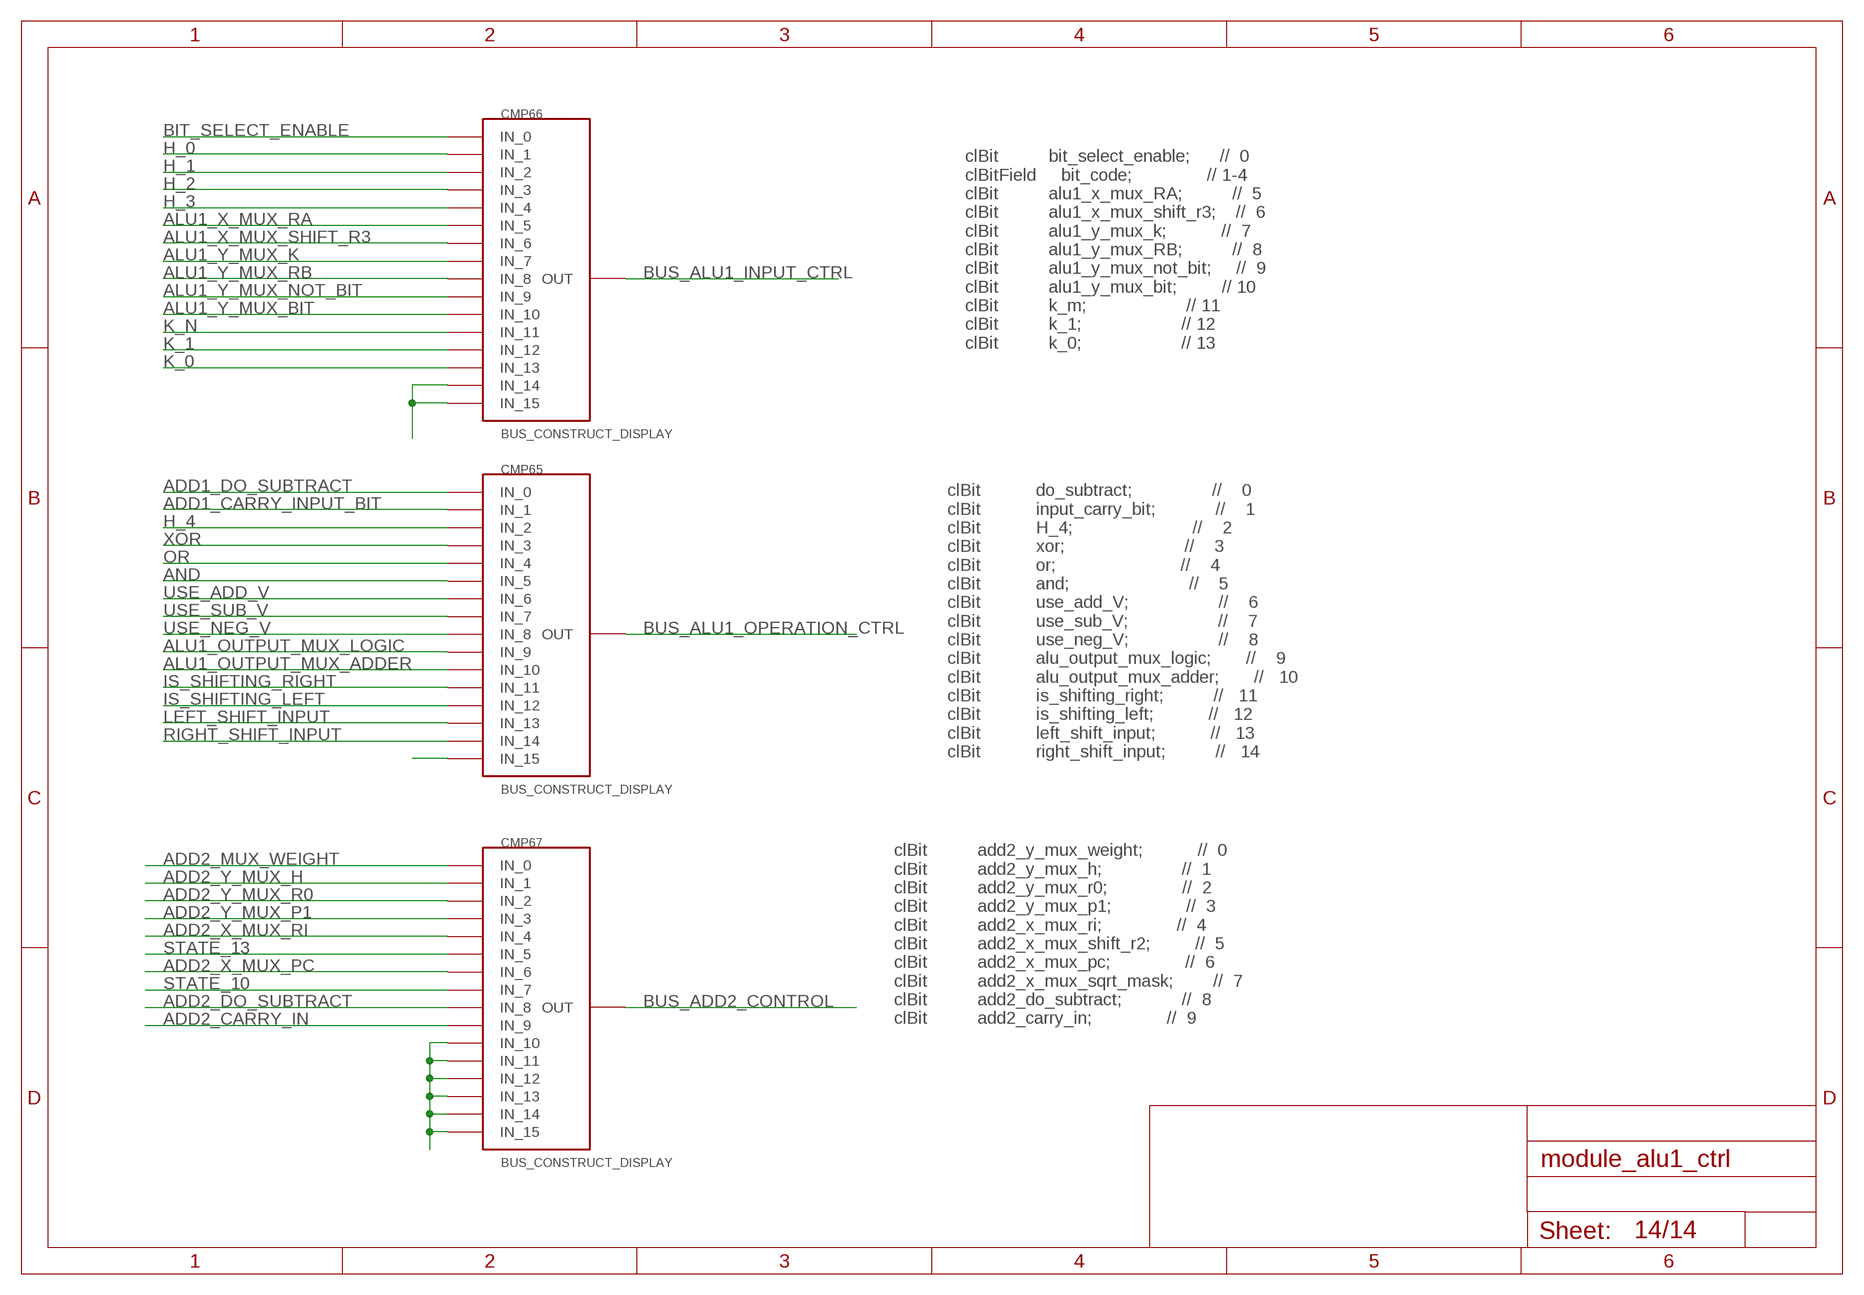
[diagram p13: schematic, sheet 14]

### Parts
CMP65  BUS_CONSTRUCT_DISPLAY  [BUS_SPLIT_DISPLAY]
CMP66  BUS_CONSTRUCT_DISPLAY  [BUS_SPLIT_DISPLAY]
CMP67  BUS_CONSTRUCT_DISPLAY  [BUS_SPLIT_DISPLAY]

### Nets
ADD1_CARRY_INPUT_BIT: CMP65.P$2(IN_1) ; also sheet 7
ADD1_DO_SUBTRACT: CMP65.P$1(IN_0) ; also sheet 7
ADD2_CARRY_IN: CMP67.P$10(IN_9) ; also sheet 13
ADD2_DO_SUBTRACT: CMP67.P$9(IN_8) ; also sheet 13
ADD2_MUX_WEIGHT: CMP67.P$1(IN_0) ; also sheet 11,13
ADD2_X_MUX_PC: CMP67.P$7(IN_6) ; also sheet 11
ADD2_X_MUX_RI: CMP67.P$5(IN_4) ; also sheet 11
ADD2_Y_MUX_H: CMP67.P$2(IN_1) ; also sheet 12,13
ADD2_Y_MUX_P1: CMP67.P$4(IN_3) ; also sheet 13
ADD2_Y_MUX_R0: CMP67.P$3(IN_2) ; also sheet 12,13
ALU1_OUTPUT_MUX_ADDER: CMP65.P$11(IN_10) ; also sheet 10
ALU1_OUTPUT_MUX_LOGIC: CMP65.P$10(IN_9) ; also sheet 10
ALU1_X_MUX_RA: CMP66.P$6(IN_5) ; also sheet 6
ALU1_X_MUX_SHIFT_R3: CMP66.P$7(IN_6) ; also sheet 5
ALU1_Y_MUX_BIT: CMP66.P$11(IN_10) ; also sheet 6
ALU1_Y_MUX_K: CMP66.P$8(IN_7) ; also sheet 6
ALU1_Y_MUX_NOT_BIT: CMP66.P$10(IN_9) ; also sheet 6
ALU1_Y_MUX_RB: CMP66.P$9(IN_8) ; also sheet 6
AND: CMP65.P$6(IN_5) ; also sheet 10
BIT_SELECT_ENABLE: CMP66.P$1(IN_0) ; also sheet 5
BUS_ADD2_CONTROL: CMP67.INPUT(OUT)
BUS_ALU1_INPUT_CTRL: CMP66.INPUT(OUT)
BUS_ALU1_OPERATION_CTRL: CMP65.INPUT(OUT)
H_0: CMP66.P$2(IN_1) ; also sheet 1
H_1: CMP66.P$3(IN_2) ; also sheet 1,4
H_2: CMP66.P$4(IN_3) ; also sheet 1,4
H_3: CMP66.P$5(IN_4) ; also sheet 1,4
H_4: CMP65.P$3(IN_2) ; also sheet 1,7,8
IS_SHIFTING_LEFT: CMP65.P$13(IN_12) ; also sheet 8,10
IS_SHIFTING_RIGHT: CMP65.P$12(IN_11) ; also sheet 8,10
K_0: CMP66.P$14(IN_13) ; also sheet 3
K_1: CMP66.P$13(IN_12) ; also sheet 3
K_N: CMP66.P$12(IN_11) ; also sheet 3
LEFT_SHIFT_INPUT: CMP65.P$14(IN_13) ; also sheet 9
N$22: CMP66.P$15(IN_14) CMP66.P$16(IN_15)
N$23: CMP65.P$16(IN_15)
N$24: CMP67.P$11(IN_10) CMP67.P$12(IN_11) CMP67.P$13(IN_12) CMP67.P$14(IN_13) CMP67.P$15(IN_14) CMP67.P$16(IN_15)
OR: CMP65.P$5(IN_4) ; also sheet 10
RIGHT_SHIFT_INPUT: CMP65.P$15(IN_14) ; also sheet 9
STATE_10: CMP67.P$8(IN_7) ; also sheet 2,11,12
STATE_13: CMP67.P$6(IN_5) ; also sheet 2,5,6,11,12
USE_ADD_V: CMP65.P$7(IN_6) ; also sheet 8
USE_NEG_V: CMP65.P$9(IN_8) ; also sheet 8
USE_SUB_V: CMP65.P$8(IN_7) ; also sheet 8
XOR: CMP65.P$4(IN_3) ; also sheet 10

### Notes on the sheet
- clBit          bit_select_enable;      //  0
      clBitField     bit_code;               // 1-4
      clBit          alu1_x_mux_RA;          //  5
      clBit          alu1_x_mux_shift_r3;    //  6
      clBit          alu1_y_mux_k;           //  7
      clBit          alu1_y_mux_RB;          //  8
      clBit          alu1_y_mux_not_bit;     //  9
      clBit          alu1_y_mux_bit;         // 10
      clBit          k_m;                    // 11
      clBit          k_1;                    // 12
      clBit          k_0;                    // 13
- clBit           do_subtract;                //    0  
      clBit           input_carry_bit;            //    1
      clBit           H_4;                        //    2
      clBit           xor;                        //    3
      clBit           or;                         //    4
      clBit           and;                        //    5
      clBit           use_add_V;                  //    6
      clBit           use_sub_V;                  //    7
      clBit           use_neg_V;                  //    8
      clBit           alu_output_mux_logic;       //    9
      clBit           alu_output_mux_adder;       //   10
      clBit           is_shifting_right;          //   11
      clBit           is_shifting_left;           //   12
      clBit           left_shift_input;           //   13
      clBit           right_shift_input;          //   14
- clBit          add2_y_mux_weight;           //  0
      clBit          add2_y_mux_h;                //  1
      clBit          add2_y_mux_r0;               //  2
      clBit          add2_y_mux_p1;               //  3
      clBit          add2_x_mux_ri;               //  4
      clBit          add2_x_mux_shift_r2;         //  5
      clBit          add2_x_mux_pc;               //  6
      clBit          add2_x_mux_sqrt_mask;        //  7
      clBit          add2_do_subtract;            //  8
      clBit          add2_carry_in;               //  9

## Library data of the parts
CMP1 CMP12 CMP13 CMP15 CMP21 CMP22 CMP88 CMP92 CMP94 = modules:BUS_SPLIT_DISPLAY
CMP2 CMP8 CMP17 CMP30 CMP34 CMP46 = modules:3OR
CMP3 CMP11 CMP16 CMP19 CMP20 CMP23 CMP32 CMP47 = modules:2AND
CMP4 CMP14 CMP28 CMP33 CMP42 CMP43 CMP45 CMP48 = modules:2X2AND_OR
CMP5 CMP26 CMP29 = modules:8OR
CMP6 CMP9 CMP18 CMP24 CMP27 CMP44 CMP51 CMP61 = modules:2OR
CMP7 CMP52 = modules:4X2AND_OR
CMP10 = modules:DECODER4
CMP25 CMP38 CMP41 CMP57 = modules:1BUF
CMP31 CMP49 CMP50 CMP53 = modules:4OR
CMP35 = modules:DECODER16
CMP36 CMP37 CMP56 CMP59 = modules:3AND
CMP39 CMP65-CMP67 = modules:BUS_CONSTRUCT_DISPLAY
CMP40 = modules:BUS_2_BUS
CMP54 CMP60 CMP62 = modules:5OR
CMP55 = modules:8X2AND_OR